# Altium project TEBF0808.PrjPCB (part 3 of 6)

## Sheet SC.schdoc: TEBF0808 - CPLD
size A4; DocumentNumber: TEBF0808; Revision: 04; SheetNumber: 26; SheetTotal: 36; Date: 2016-09-29; CompanyName: Trenz Electronic GmbH; Organization: Trenz Electronic GmbH
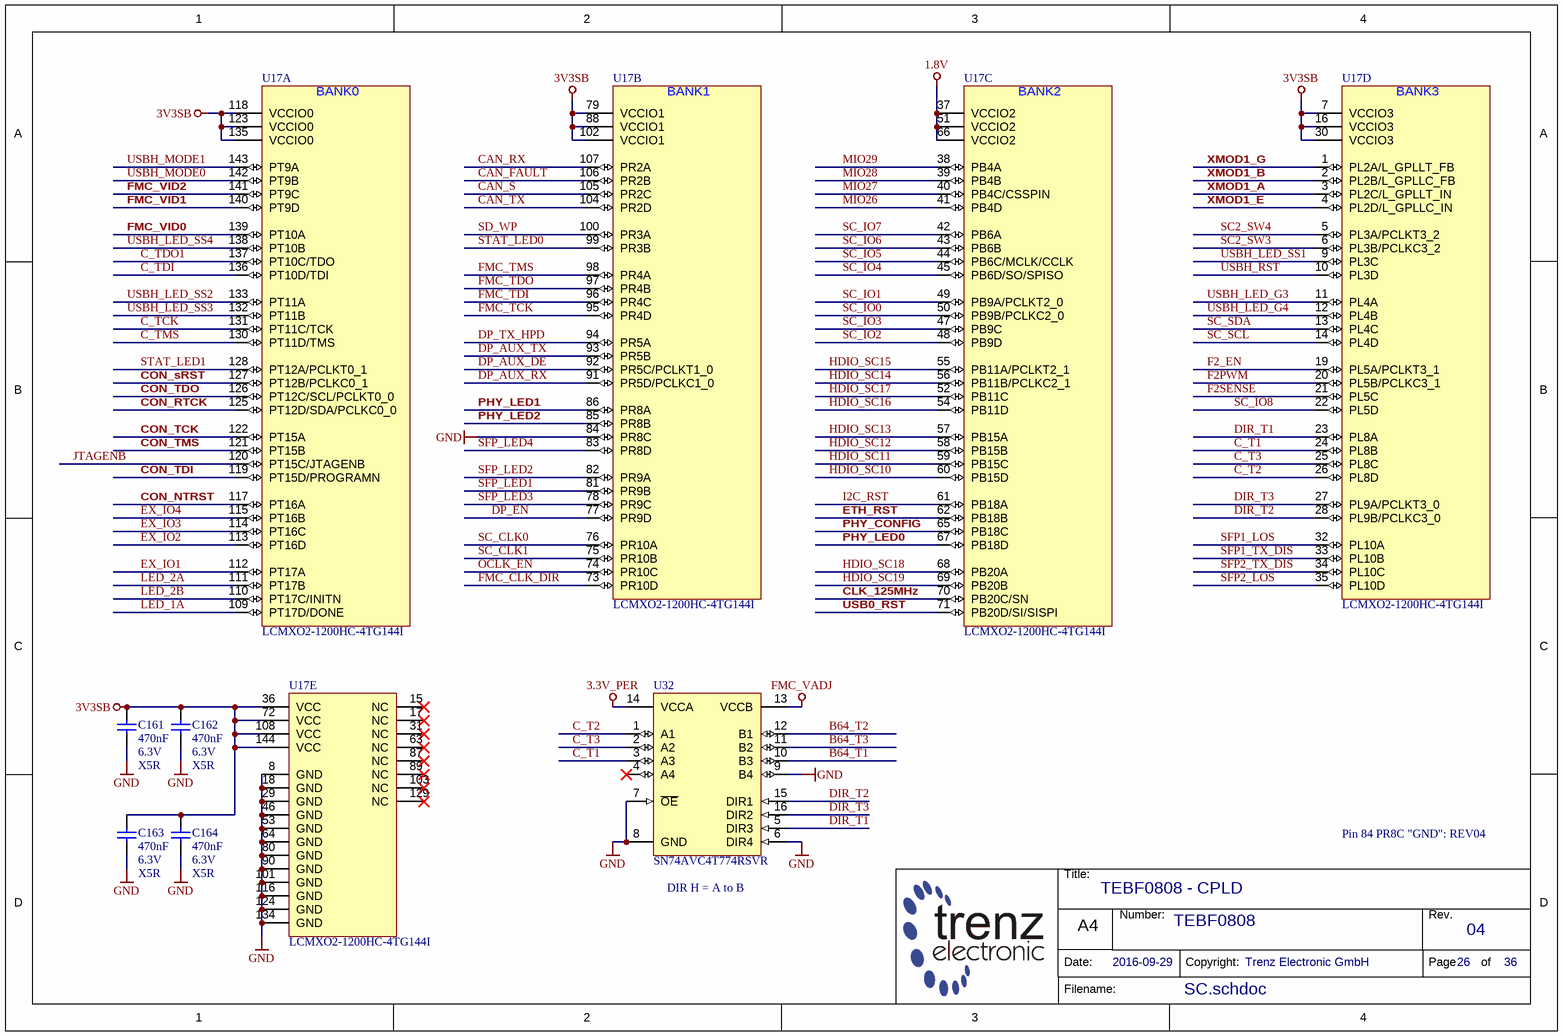
[diagram p11: SC.schdoc]

### Parts
C161  470nF  Voltage: 6.3V  Technology: X5R  [CAPC1005X55N]
C162  470nF  Voltage: 6.3V  Technology: X5R  [CAPC1005X55N]
C163  470nF  Voltage: 6.3V  Technology: X5R  [CAPC1005X55N]
C164  470nF  Voltage: 6.3V  Technology: X5R  [CAPC1005X55N]
U17  LCMXO2-1200HC-4TG144I  [QFP50P2200X2200X160-144N]  (parts A,B,C,D,E of 5)
U32  SN74AVC4T774RSVR  [QFN40P260X180X55-16N]

### Nets
1.8V: U17.37(VCCIO2) U17.51(VCCIO2) U17.66(VCCIO2)
3.3V_PER: U32.14(VCCA)
3V3SB: C161.1 C162.1 C163.1 C164.1 U17.7(VCCIO3) U17.16(VCCIO3) U17.30(VCCIO3) U17.36(VCC) U17.72(VCC) U17.79(VCCIO1) U17.88(VCCIO1) U17.102(VCCIO1) U17.108(VCC) U17.118(VCCIO0) U17.123(VCCIO0) U17.135(VCCIO0) U17.144(VCC)
FMC_VADJ: U32.13(VCCB)
GND: C161.2 C162.2 C163.2 C164.2 U17.8(GND) U17.18(GND) U17.29(GND) U17.46(GND) U17.53(GND) U17.64(GND) U17.80(GND) U17.84(PR8C) U17.90(GND) U17.101(GND) U17.116(GND) U17.124(GND) U17.134(GND) U32.6(DIR4) U32.7(~{OE}) U32.8(GND) U32.9(B4)
B64_T1: U32.10(B3)
B64_T2: U32.12(B1)
B64_T3: U32.11(B2)
C_T1: U17.24(PL8B) U32.3(A3)
C_T2: U17.26(PL8D) U32.1(A1)
C_T3: U17.25(PL8C) U32.2(A2)
C_TCK: U17.131(PT11C/TCK)
C_TDI: U17.136(PT10D/TDI)
C_TDO1: U17.137(PT10C/TDO)
C_TMS: U17.130(PT11D/TMS)
CAN_FAULT: U17.106(PR2B)
CAN_RX: U17.107(PR2A)
CAN_S: U17.105(PR2C)
CAN_TX: U17.104(PR2D)
CLK_125MHz: U17.70(PB20C/SN)
CON_NTRST: U17.117(PT16A)
CON_RTCK: U17.125(PT12D/SDA/PCLKC0_0)
CON_sRST: U17.127(PT12B/PCLKC0_1)
CON_TCK: U17.122(PT15A)
CON_TDI: U17.119(PT15D/PROGRAMN)
CON_TDO: U17.126(PT12C/SCL/PCLKT0_0)
CON_TMS: U17.121(PT15B)
DIR_T1: U17.23(PL8A) U32.5(DIR3)
DIR_T2: U17.28(PL9B/PCLKC3_0) U32.15(DIR1)
DIR_T3: U17.27(PL9A/PCLKT3_0) U32.16(DIR2)
DP_AUX_DE: U17.92(PR5C/PCLKT1_0)
DP_AUX_RX: U17.91(PR5D/PCLKC1_0)
DP_AUX_TX: U17.93(PR5B)
DP_EN: U17.77(PR9D)
DP_TX_HPD: U17.94(PR5A)
ETH_RST: U17.62(PB18B)
EX_IO1: U17.112(PT17A)
EX_IO2: U17.113(PT16D)
EX_IO3: U17.114(PT16C)
EX_IO4: U17.115(PT16B)
F2_EN: U17.19(PL5A/PCLKT3_1)
F2PWM: U17.20(PL5B/PCLKC3_1)
F2SENSE: U17.21(PL5C)
FMC_CLK_DIR: U17.73(PR10D)
FMC_TCK: U17.95(PR4D)
FMC_TDI: U17.96(PR4C)
FMC_TDO: U17.97(PR4B)
FMC_TMS: U17.98(PR4A)
FMC_VID0: U17.139(PT10A)
FMC_VID1: U17.140(PT9D)
FMC_VID2: U17.141(PT9C)
HDIO_SC10: U17.60(PB15D)
HDIO_SC11: U17.59(PB15C)
HDIO_SC12: U17.58(PB15B)
HDIO_SC13: U17.57(PB15A)
HDIO_SC14: U17.56(PB11B/PCLKC2_1)
HDIO_SC15: U17.55(PB11A/PCLKT2_1)
HDIO_SC16: U17.54(PB11D)
HDIO_SC17: U17.52(PB11C)
HDIO_SC18: U17.68(PB20A)
HDIO_SC19: U17.69(PB20B)
I2C_RST: U17.61(PB18A)
JTAGENB: U17.120(PT15C/JTAGENB)
LED_1A: U17.109(PT17D/DONE)
LED_2A: U17.111(PT17B)
LED_2B: U17.110(PT17C/INITN)
MIO26: U17.41(PB4D)
MIO27: U17.40(PB4C/CSSPIN)
MIO28: U17.39(PB4B)
MIO29: U17.38(PB4A)
OCLK_EN: U17.74(PR10C)
PHY_CONFIG: U17.65(PB18C)
PHY_LED0: U17.67(PB18D)
PHY_LED1: U17.86(PR8A)
PHY_LED2: U17.85(PR8B)
SC2_SW3: U17.6(PL3B/PCLKC3_2)
SC2_SW4: U17.5(PL3A/PCLKT3_2)
SC_CLK0: U17.76(PR10A)
SC_CLK1: U17.75(PR10B)
SC_IO0: U17.50(PB9B/PCLKC2_0)
SC_IO1: U17.49(PB9A/PCLKT2_0)
SC_IO2: U17.48(PB9D)
SC_IO3: U17.47(PB9C)
SC_IO4: U17.45(PB6D/SO/SPISO)
SC_IO5: U17.44(PB6C/MCLK/CCLK)
SC_IO6: U17.43(PB6B)
SC_IO7: U17.42(PB6A)
SC_IO8: U17.22(PL5D)
SC_SCL: U17.14(PL4D)
SC_SDA: U17.13(PL4C)
SD_WP: U17.100(PR3A)
SFP1_LOS: U17.32(PL10A)
SFP1_TX_DIS: U17.33(PL10B)
SFP2_LOS: U17.35(PL10D)
SFP2_TX_DIS: U17.34(PL10C)
SFP_LED1: U17.81(PR9B)
SFP_LED2: U17.82(PR9A)
SFP_LED3: U17.78(PR9C)
SFP_LED4: U17.83(PR8D)
STAT_LED0: U17.99(PR3B)
STAT_LED1: U17.128(PT12A/PCLKT0_1)
USB0_RST: U17.71(PB20D/SI/SISPI)
USBH_LED_G3: U17.11(PL4A)
USBH_LED_G4: U17.12(PL4B)
USBH_LED_SS1: U17.9(PL3C)
USBH_LED_SS2: U17.133(PT11A)
USBH_LED_SS3: U17.132(PT11B)
USBH_LED_SS4: U17.138(PT10B)
USBH_MODE0: U17.142(PT9B)
USBH_MODE1: U17.143(PT9A)
USBH_RST: U17.10(PL3D)
XMOD1_A: U17.3(PL2C/L_GPLLT_IN)
XMOD1_B: U17.2(PL2B/L_GPLLC_FB)
XMOD1_E: U17.4(PL2D/L_GPLLC_IN)
XMOD1_G: U17.1(PL2A/L_GPLLT_FB)

Not connected (* = marked no-connect by the designer): U17 15(NC)* 17(NC)* 31(NC)* 63(NC)* 87(NC)* 89(NC)* 103(NC)* 129(NC)*; U32 4(A4)*

### Notes on the sheet
- Pin 84 PR8C "GND": REV04
- (near U32) DIR H = A to B
- Title:
- Number:
- Rev.
- Date:
- A4
- Copyright:
- Page
- of
- Filename:
- (in symbol 25915, part A) BANK0
- (in symbol 25915, part B) BANK1
- (in symbol 25915, part C) BANK2
- (in symbol 25915, part D) BANK3

### Library data of the parts
C161-C164 = 23659: KON 470nF 6,3V X5R SMD; AN: 23659; Mixed: SMT; Value: 470n; Preferred: Yes; Case: 1005 (0402)
U17 = 25915: AN: 25915; Mixed: SMT; Trenz-Stock: Yes; Case: TQFP144; HelpURL: B:\AD\adlib\datasheet\MachXO2; H-ART: LCMXO2-1200HC-4TG144I
U32 = 27170: AN: 27170; Mixed: SMT; Trenz-Stock: Yes; Case: UQFN-16; HelpURL: B:\ad\adlib\datasheet\sn74avc4t774; H-ART: SN74AVC4T774RSVR

## Sheet SC2.schdoc: TEBF0808 - CPLD_2
size A4; DocumentNumber: TEBF0808; Revision: 04; SheetNumber: 27; SheetTotal: 36; Date: 2016-09-29; CompanyName: Trenz Electronic GmbH; Organization: Trenz Electronic GmbH
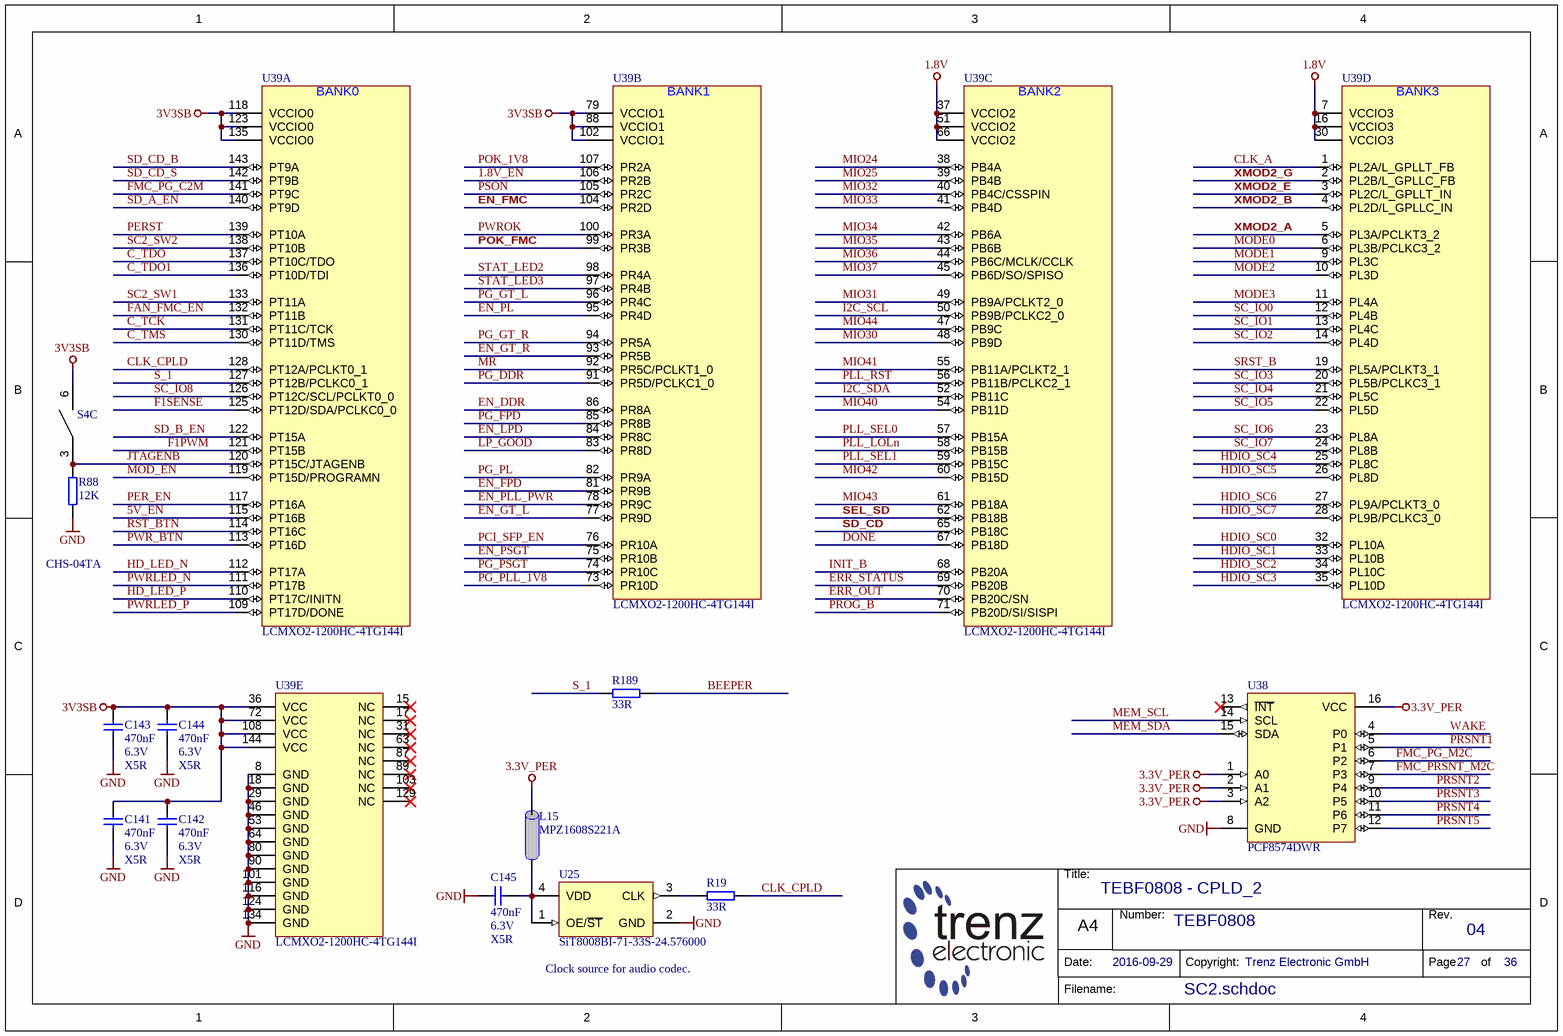
[diagram p12: SC2.schdoc]

### Parts
C141  470nF  Voltage: 6.3V  Technology: X5R  [CAPC1005X55N]
C142  470nF  Voltage: 6.3V  Technology: X5R  [CAPC1005X55N]
C143  470nF  Voltage: 6.3V  Technology: X5R  [CAPC1005X55N]
C144  470nF  Voltage: 6.3V  Technology: X5R  [CAPC1005X55N]
C145  470nF  Voltage: 6.3V  Technology: X5R  [CAPC1005X55N]
L15  MPZ1608S221A  [INDC1608X95N]
R19  33R  [RESC1005X40N]
R88  12K  [RESC1005X40N]
R189  33R  [RESC1005X40N]
S4  CHS-04TA  [CHS-04TA]  (part C of 4)
U25  SiT8008BI-71-33S-24.576000  [2016]
U38  PCF8574DWR  [SOIC127P1030X265-16N]
U39  LCMXO2-1200HC-4TG144I  [QFP50P2200X2200X160-144N]  (parts A,B,C,D,E of 5)

### Nets
1.8V: U39.7(VCCIO3) U39.16(VCCIO3) U39.30(VCCIO3) U39.37(VCCIO2) U39.51(VCCIO2) U39.66(VCCIO2)
3.3V_PER: L15.2 U38.1(A0) U38.2(A1) U38.3(A2) U38.16(VCC)
3V3SB: C141.1 C142.1 C143.1 C144.1 S4.6 U39.36(VCC) U39.72(VCC) U39.79(VCCIO1) U39.88(VCCIO1) U39.102(VCCIO1) U39.108(VCC) U39.118(VCCIO0) U39.123(VCCIO0) U39.135(VCCIO0) U39.144(VCC)
GND: C141.2 C142.2 C143.2 C144.2 C145.2 R88.1 U25.2(GND) U38.8(GND) U39.8(GND) U39.18(GND) U39.29(GND) U39.46(GND) U39.53(GND) U39.64(GND) U39.80(GND) U39.90(GND) U39.101(GND) U39.116(GND) U39.124(GND) U39.134(GND)
1.8V_EN: U39.106(PR2B)
5V_EN: U39.115(PT16B)
BEEPER: R189.2
C_TCK: U39.131(PT11C/TCK)
C_TDO: U39.137(PT10C/TDO)
C_TDO1: U39.136(PT10D/TDI)
C_TMS: U39.130(PT11D/TMS)
CLK_A: U39.1(PL2A/L_GPLLT_FB)
CLK_CPLD: R19.2 U39.128(PT12A/PCLKT0_1)
DONE: U39.67(PB18D)
EN_DDR: U39.86(PR8A)
EN_FMC: U39.104(PR2D)
EN_FPD: U39.81(PR9B)
EN_GT_L: U39.77(PR9D)
EN_GT_R: U39.93(PR5B)
EN_LPD: U39.84(PR8C)
EN_PL: U39.95(PR4D)
EN_PLL_PWR: U39.78(PR9C)
EN_PSGT: U39.75(PR10B)
ERR_OUT: U39.70(PB20C/SN)
ERR_STATUS: U39.69(PB20B)
F1PWM: U39.121(PT15B)
F1SENSE: U39.125(PT12D/SDA/PCLKC0_0)
FAN_FMC_EN: U39.132(PT11B)
FMC_PG_C2M: U39.141(PT9C)
FMC_PG_M2C: U38.6(P2)
FMC_PRSNT_M2C: U38.7(P3)
HD_LED_N: U39.112(PT17A)
HD_LED_P: U39.110(PT17C/INITN)
HDIO_SC0: U39.32(PL10A)
HDIO_SC1: U39.33(PL10B)
HDIO_SC2: U39.34(PL10C)
HDIO_SC3: U39.35(PL10D)
HDIO_SC4: U39.25(PL8C)
HDIO_SC5: U39.26(PL8D)
HDIO_SC6: U39.27(PL9A/PCLKT3_0)
HDIO_SC7: U39.28(PL9B/PCLKC3_0)
I2C_SCL: U39.50(PB9B/PCLKC2_0)
I2C_SDA: U39.52(PB11C)
INIT_B: U39.68(PB20A)
JTAGENB: R88.2 S4.3 U39.120(PT15C/JTAGENB)
LP_GOOD: U39.83(PR8D)
MEM_SCL: U38.14(SCL)
MEM_SDA: U38.15(SDA)
MIO24: U39.38(PB4A)
MIO25: U39.39(PB4B)
MIO30: U39.48(PB9D)
MIO31: U39.49(PB9A/PCLKT2_0)
MIO32: U39.40(PB4C/CSSPIN)
MIO33: U39.41(PB4D)
MIO34: U39.42(PB6A)
MIO35: U39.43(PB6B)
MIO36: U39.44(PB6C/MCLK/CCLK)
MIO37: U39.45(PB6D/SO/SPISO)
MIO40: U39.54(PB11D)
MIO41: U39.55(PB11A/PCLKT2_1)
MIO42: U39.60(PB15D)
MIO43: U39.61(PB18A)
MIO44: U39.47(PB9C)
MOD_EN: U39.119(PT15D/PROGRAMN)
MODE0: U39.6(PL3B/PCLKC3_2)
MODE1: U39.9(PL3C)
MODE2: U39.10(PL3D)
MODE3: U39.11(PL4A)
MR: U39.92(PR5C/PCLKT1_0)
PCI_SFP_EN: U39.76(PR10A)
PER_EN: U39.117(PT16A)
PERST: U39.139(PT10A)
PG_DDR: U39.91(PR5D/PCLKC1_0)
PG_FPD: U39.85(PR8B)
PG_GT_L: U39.96(PR4C)
PG_GT_R: U39.94(PR5A)
PG_PL: U39.82(PR9A)
PG_PLL_1V8: U39.73(PR10D)
PG_PSGT: U39.74(PR10C)
PLL_LOLn: U39.58(PB15B)
PLL_RST: U39.56(PB11B/PCLKC2_1)
PLL_SEL0: U39.57(PB15A)
PLL_SEL1: U39.59(PB15C)
POK_1V8: U39.107(PR2A)
POK_FMC: U39.99(PR3B)
PROG_B: U39.71(PB20D/SI/SISPI)
PRSNT1: U38.5(P1)
PRSNT2: U38.9(P4)
PRSNT3: U38.10(P5)
PRSNT4: U38.11(P6)
PRSNT5: U38.12(P7)
PSON: U39.105(PR2C)
PWR_BTN: U39.113(PT16D)
PWRLED_N: U39.111(PT17B)
PWRLED_P: U39.109(PT17D/DONE)
PWROK: U39.100(PR3A)
RST_BTN: U39.114(PT16C)
S_1: R189.1 U39.127(PT12B/PCLKC0_1)
SC2_SW1: U39.133(PT11A)
SC2_SW2: U39.138(PT10B)
SC_IO0: U39.12(PL4B)
SC_IO1: U39.13(PL4C)
SC_IO2: U39.14(PL4D)
SC_IO3: U39.20(PL5B/PCLKC3_1)
SC_IO4: U39.21(PL5C)
SC_IO5: U39.22(PL5D)
SC_IO6: U39.23(PL8A)
SC_IO7: U39.24(PL8B)
SC_IO8: U39.126(PT12C/SCL/PCLKT0_0)
SD_A_EN: U39.140(PT9D)
SD_B_EN: U39.122(PT15A)
SD_CD: U39.65(PB18C)
SD_CD_B: U39.143(PT9A)
SD_CD_S: U39.142(PT9B)
SEL_SD: U39.62(PB18B)
SRST_B: U39.19(PL5A/PCLKT3_1)
STAT_LED2: U39.98(PR4A)
STAT_LED3: U39.97(PR4B)
WAKE: U38.4(P0)
XMOD2_A: U39.5(PL3A/PCLKT3_2)
XMOD2_B: U39.4(PL2D/L_GPLLC_IN)
XMOD2_E: U39.3(PL2C/L_GPLLT_IN)
XMOD2_G: U39.2(PL2B/L_GPLLC_FB)
NetC145_1: C145.1 L15.1 U25.1(OE/~{ST}) U25.4(VDD)
NetR19_1: R19.1 U25.3(CLK)

Not connected (* = marked no-connect by the designer): U38 13(~{INT})*; U39 15(NC)* 17(NC)* 31(NC)* 63(NC)* 87(NC)* 89(NC)* 103(NC)* 129(NC)*

### Notes on the sheet
- (near U25) Clock source for audio codec.
- Title:
- Number:
- Rev.
- Date:
- A4
- Copyright:
- Page
- of
- Filename:
- (in symbol 25915, part A) BANK0
- (in symbol 25915, part B) BANK1
- (in symbol 25915, part C) BANK2
- (in symbol 25915, part D) BANK3

### Library data of the parts
C141-C144 = 23659: as C161-C164 on sheet SC; Case: 1005 (0402)
C145 = 23659: KON 470nF 6,3V X5R SMD; AN: 23659; Value: 470n; Mixed: SMT; Preferred: Yes; Case: 1005 (0402)
L15 = 22718: Ferritdurchführung MPZ1608S221A; AN: 22718; Mixed: SMT; Trenz-Stock: Yes; Value: 220 OHm @ 100MHz; Case: 1608 (0603); HelpURL: B:\AD\adlib\datasheet\MPZ1608; Preferred: Yes; H-ART: MPZ1608S221A
R19 R189 = 22770: WID SMD 33R 1% 0,063W; AN: 22770; Mixed: SMT; Value: 33; Preferred: Yes; Tolerance: 1%; Case: 1005 (0402); Technology: TK100
R88 = 22598: WID SMD 12K 1% 0,063W; AN: 22598; Mixed: SMT; Preferred: Yes; Tolerance: 1%; Case: 1005 (0402); Technology: TK100; Value: 12K
S4 = 23417: DIP Schalter 4 fach 1,27mm SMD; AN: 23417; Mixed: SMT; Trenz-Stock: Yes; HelpURL: B:\AD\adlib\datasheet\CHS; Preferred: Yes; H-ART: CHS-04TA
U25 = 27547: SiT8008BI-71-33S-24.576000 MEMS Oszillator 24.576000MHz; AN: 27547; Mixed: SMT; Trenz-Stock: Yes; Value: 24.576M; Case: 2.0  x 1.6mm; HelpURL: B:\AD\adlib\datasheet\SiT8008; Preferred: Yes; H-ART: SiT8008BI-71-33S-24.576000
U38 = 26502: AN: 26502; Mixed: SMT; Case: SO16W DW; HelpURL: B:\AD\adlib\datasheet\PCF8574; H-ART: PCF8574DWR
U39 = 25915: AN: 25915; Mixed: SMT; Trenz-Stock: Yes; Case: TQFP144; HelpURL: B:\AD\adlib\datasheet\MachXO2; H-ART: LCMXO2-1200HC-4TG144I

## Sheet XMOD.schdoc: TEBF0808 - XMOD JTAG
size A4; DocumentNumber: TEBF0808; Revision: 04; SheetNumber: 29; SheetTotal: 36; Date: 2016-09-29; CompanyName: Trenz Electronic GmbH; Organization: Trenz Electronic GmbH
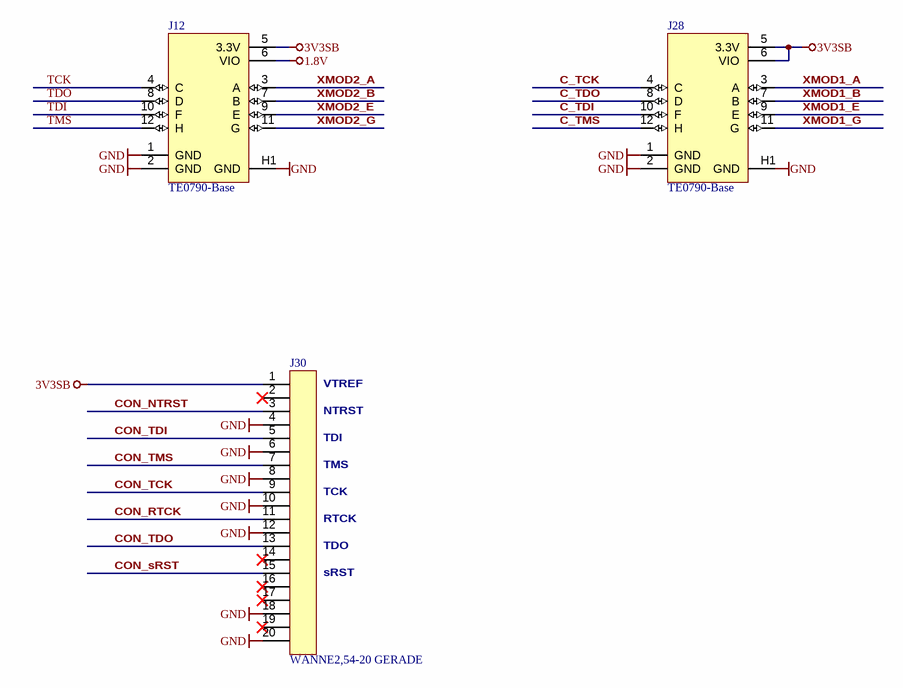
[diagram p13: XMOD.schdoc]

### Parts
J12  TE0790-Base  [TE0790-Base]
J28  TE0790-Base  [TE0790-Base]
J30  WANNE2,54-20 GERADE  [WANNE2,54-20 GERADE]

### Nets
1.8V: J12.6(VIO)
3V3SB: J12.5(3.3V) J28.5(3.3V) J28.6(VIO) J30.1
GND: J12.1(GND) J12.2(GND) J12.H1(GND) J28.1(GND) J28.2(GND) J28.H1(GND) J30.4 J30.6 J30.8 J30.10 J30.12 J30.18 J30.20
C_TCK: J28.4(C)
C_TDI: J28.10(F)
C_TDO: J28.8(D)
C_TMS: J28.12(H)
CON_NTRST: J30.3
CON_RTCK: J30.11
CON_sRST: J30.15
CON_TCK: J30.9
CON_TDI: J30.5
CON_TDO: J30.13
CON_TMS: J30.7
TCK: J12.4(C)
TDI: J12.10(F)
TDO: J12.8(D)
TMS: J12.12(H)
XMOD1_A: J28.3(A)
XMOD1_B: J28.7(B)
XMOD1_E: J28.9(E)
XMOD1_G: J28.11(G)
XMOD2_A: J12.3(A)
XMOD2_B: J12.7(B)
XMOD2_E: J12.9(E)
XMOD2_G: J12.11(G)

Not connected (* = marked no-connect by the designer): J30 2* 14* 16* 17* 19*

### Notes on the sheet
- (near J30) VTREF
- (near J30) TDI
- (near J30) NTRST
- (near J30) TMS
- (near J30) TCK
- (near J30) RTCK
- (near J30) TDO
- (near J30) sRST
- Title:
- Number:
- Rev.
- Date:
- A4
- Copyright:
- Page
- of
- Filename:

### Library data of the parts
J12 J28 = 26694: AN: 26694; Mixed: THT; Trenz-Article-Number: 22495
J30 = 20127: Stiftleiste Wanne 20polig; AN: 20127; Trenz-Stock: Yes; Mixed: THT; HelpURL: B:\AD\adlib\datasheet\137

## Sheet Power_1.schdoc: TEBF0808 - Power
size A4; DocumentNumber: TEBF0808; Revision: 04; SheetNumber: 31; SheetTotal: 36; Date: 2016-09-29; CompanyName: Trenz Electronic GmbH; Organization: Trenz Electronic GmbH
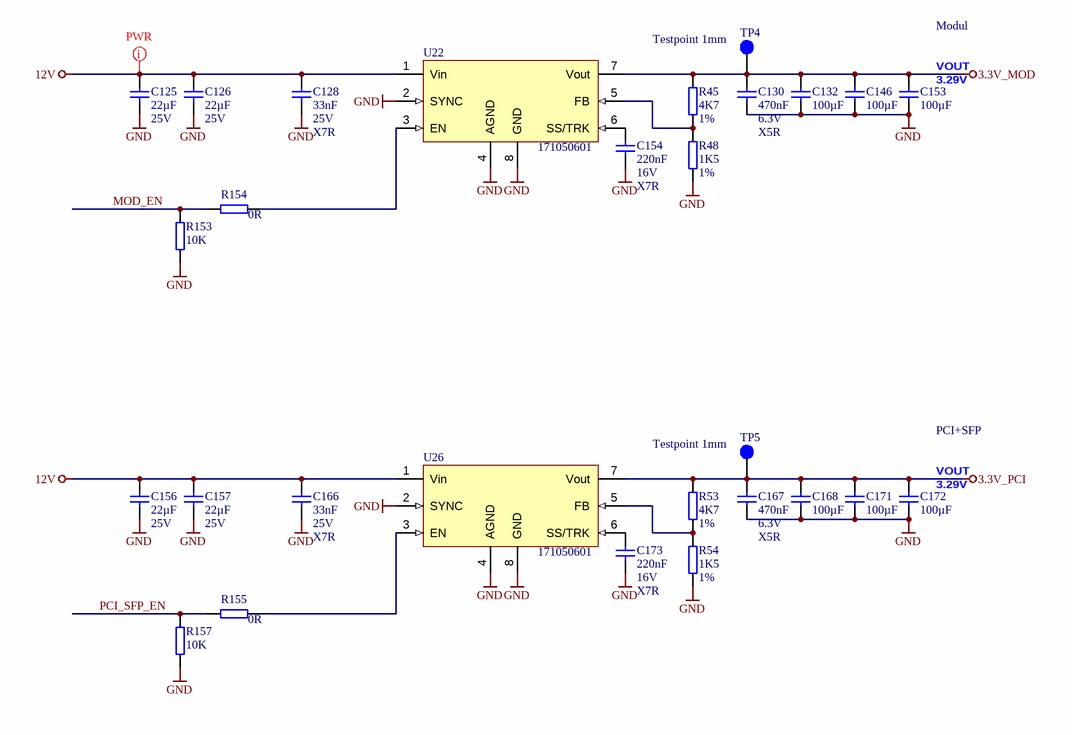
[diagram p14: Power_1.schdoc]

### Parts
C125  22µF  Voltage: 25V  [CAPC3216X180N]
C126  22µF  Voltage: 25V  [CAPC3216X180N]
C128  33nF  Voltage: 25V  Technology: X7R  [CAPC1005X55N]
C130  470nF  Voltage: 6.3V  Technology: X5R  [CAPC1005X55N]
C132  100µF  [CAPC3216X180N]
C146  100µF  [CAPC3216X180N]
C153  100µF  [CAPC3216X180N]
C154  220nF  Voltage: 16V  Technology: X7R  [CAPC1005X55N]
C156  22µF  Voltage: 25V  [CAPC3216X180N]
C157  22µF  Voltage: 25V  [CAPC3216X180N]
C166  33nF  Voltage: 25V  Technology: X7R  [CAPC1005X55N]
C167  470nF  Voltage: 6.3V  Technology: X5R  [CAPC1005X55N]
C168  100µF  [CAPC3216X180N]
C171  100µF  [CAPC3216X180N]
C172  100µF  [CAPC3216X180N]
C173  220nF  Voltage: 16V  Technology: X7R  [CAPC1005X55N]
R45  4K7  Tolerance: 1%  [RESC1005X40N]
R48  1K5  Tolerance: 1%  [RESC1005X40N]
R53  4K7  Tolerance: 1%  [RESC1005X40N]
R54  1K5  Tolerance: 1%  [RESC1005X40N]
R153  10K  [RESC1005X40N]
R154  0R  [RESC1005X40N]
R155  0R  [RESC1005X40N]
R157  10K  [RESC1005X40N]
TP4  Testpoint 1mm  [TP_1mm]
TP5  Testpoint 1mm  [TP_1mm]
U22  171050601  [7TO-PMOD]
U26  171050601  [7TO-PMOD]

### Nets
3.3V_MOD: C130.1 C132.1 C146.1 C153.1 R45.1 TP4.1 U22.7(Vout)
3.3V_PCI: C167.1 C168.1 C171.1 C172.1 R53.1 TP5.1 U26.7(Vout)
12V: C125.2 C126.2 C128.1 C156.2 C157.2 C166.1 U22.1(Vin) U26.1(Vin)
GND: C125.1 C126.1 C128.2 C130.2 C132.2 C146.2 C153.2 C154.2 C156.1 C157.1 C166.2 C167.2 C168.2 C171.2 C172.2 C173.2 R48.2 R54.2 R153.1 R157.1 U22.2(SYNC) U22.4(AGND) U22.8(GND) U26.2(SYNC) U26.4(AGND) U26.8(GND)
MOD_EN: R153.2 R154.2
PCI_SFP_EN: R155.2 R157.2
NetC154_1: C154.1 U22.6(SS/TRK)
NetC173_1: C173.1 U26.6(SS/TRK)
NetR45_2: R45.2 R48.1 U22.5(FB)
NetR53_2: R53.2 R54.1 U26.5(FB)
NetR154_1: R154.1 U22.3(EN)
NetR155_1: R155.1 U26.3(EN)

### Layout directives
net class PWR: 12V

### Notes on the sheet
- Modul
- (near C153) VOUT
- (near C153) 3.29V
- PCI+SFP
- (near C172) 3.29V
- (near C172) VOUT
- Title:
- Number:
- Rev.
- Date:
- A4
- Copyright:
- Page
- of
- Filename:

### Library data of the parts
C125 C126 C156 C157 = 24886: KON 22µF X5R 25V SMD 10%; AN: 24886; Value: 22u; Mixed: SMT; Preferred: Yes; Case: 3216 (1206); Tolerance: 10%
C128 C166 = 23916: KON 33nF 25V X7R SMD; AN: 23916; Value: 33n; Mixed: SMT; Preferred: Yes; Case: 1005 (0402)
C130 C167 = 23659: as C161-C164 on sheet SC; Case: 1005 (0402)
C132 C146 C153 C168 C171 C172 = 23116: KON 100µF 6,3V X5R SMD 20%; AN: 23116; Mixed: SMT; Value: 100u; Preferred: Yes; Voltage: 6.3V; Case: 3216 (1206); Tolerance: 20%; Technology: X5R
C154 C173 = 22768: KON 220nF 16V X7R SMD; AN: 22768; Mixed: SMT; Value: 220n; Case: 1005 (0402)
R45 R53 = 22585: WID SMD 4K7 1% 0,063W; AN: 22585; Mixed: SMT; Value: 4.7K; Preferred: Yes; Case: 1005 (0402); Technology: TK100
R48 R54 = 22602: WID SMD 1K5 1% 0,063W; AN: 22602; Mixed: SMT; Value: 1.5K; Preferred: Yes; Case: 1005 (0402); Technology: TK100
R153 R157 = 22750: WID SMD 10K 1% 0,063W; AN: 22750; Mixed: SMT; Preferred: Yes; Case: 1005 (0402); Value: 10K; Tolerance: 1%; Technology: TK100
R154 R155 = 22738: WID SMD 0R; AN: 22738; Tolerance: 1%; Mixed: SMT; Value: 0; Preferred: Yes; Case: 1005 (0402); Technology: TK100
TP4 TP5 = 25063: AN: 25063; Mixed: SMT
U22 U26 = 26051: AN: 26051; Mixed: SMT; Case: TO263-7EP; HelpURL: B:\AD\adlib\datasheet\171050601; H-ART: 171050601

## Sheet B2B.schdoc: TEBF0808 - B2B-connectors
size A4; DocumentNumber: TEBF0808; Revision: 04; SheetNumber: 2; SheetTotal: 36; Date: 2016-09-29; CompanyName: Trenz Electronic GmbH; Organization: Trenz Electronic GmbH
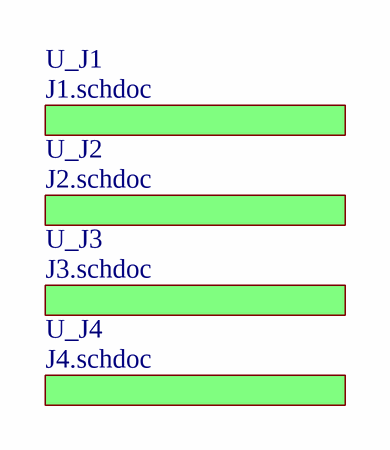
[diagram p15: B2B.schdoc]

### Sub-sheets
U_J1 = J1.schdoc: no entries
U_J2 = J2.schdoc: no entries
U_J3 = J3.schdoc: no entries
U_J4 = J4.schdoc: no entries

### Notes on the sheet
- Title:
- Number:
- Rev.
- Date:
- A4
- Copyright:
- Page
- of
- Filename:

## Sheet J1.schdoc: TEBF0808 - B2B-connector J1
size A4; DocumentNumber: TEBF0808; Revision: 04; SheetNumber: 3; SheetTotal: 36; Date: 2016-09-29; CompanyName: Trenz Electronic GmbH; Organization: Trenz Electronic GmbH
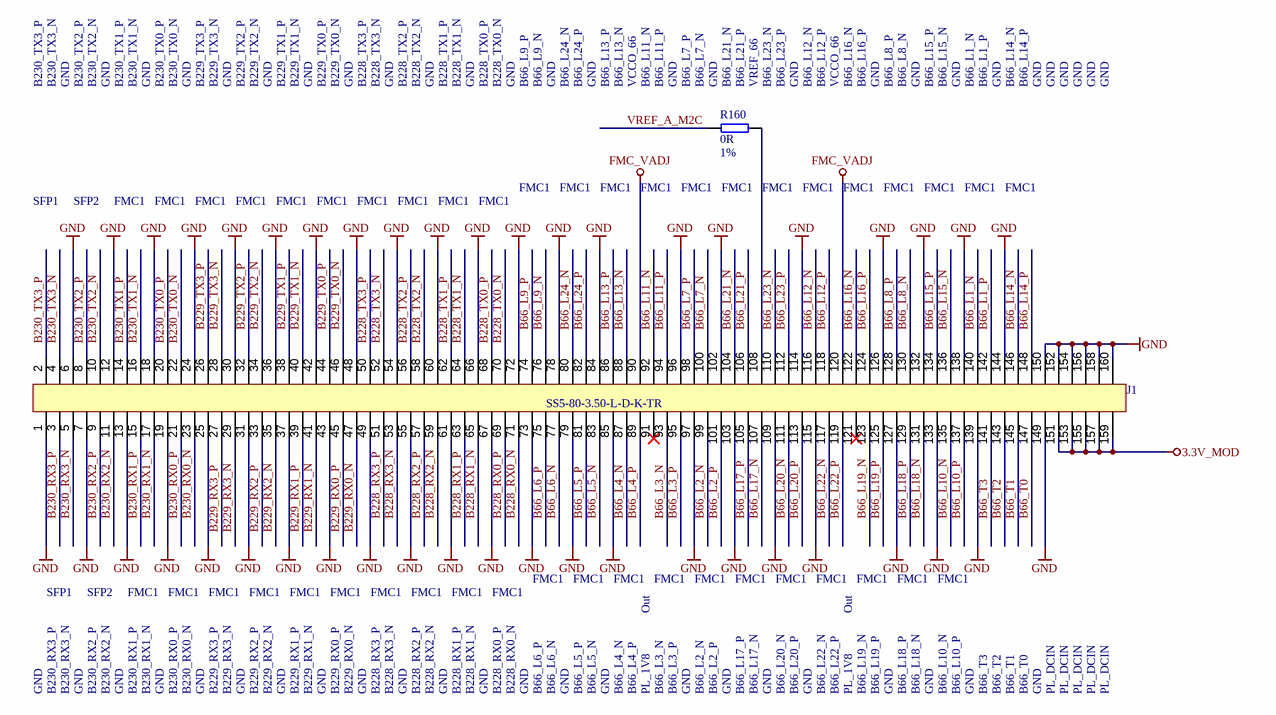
[diagram p16: J1.schdoc]

### Parts
J1  SS5-80-3.50-L-D-K-TR  [SS5-80-3.50-L-D-K-TR]
R160  0R  Tolerance: 1%  [RESC1005X40N]

### Nets
3.3V_MOD: J1.151 J1.153 J1.155 J1.157 J1.159
FMC_VADJ: J1.90 J1.120
GND: J1.1 J1.6 J1.7 J1.12 J1.13 J1.18 J1.19 J1.24 J1.25 J1.30 J1.31 J1.36 J1.37 J1.42 J1.43 J1.48 J1.49 J1.54 J1.55 J1.60 J1.61 J1.66 J1.67 J1.72 J1.73 J1.78 J1.79 J1.84 J1.85 J1.96 J1.97 J1.102 J1.103 J1.109 J1.114 J1.115 J1.126 J1.127 J1.132 J1.133 J1.138 J1.139 J1.144 J1.149 J1.150 J1.152 J1.154 J1.156 J1.158 J1.160
B66_L1_N: J1.140
B66_L1_P: J1.142
B66_L2_N: J1.99
B66_L2_P: J1.101
B66_L3_N: J1.93
B66_L3_P: J1.95
B66_L4_N: J1.87
B66_L4_P: J1.89
B66_L5_N: J1.83
B66_L5_P: J1.81
B66_L6_N: J1.77
B66_L6_P: J1.75
B66_L7_N: J1.100
B66_L7_P: J1.98
B66_L8_N: J1.130
B66_L8_P: J1.128
B66_L9_N: J1.76
B66_L9_P: J1.74
B66_L10_N: J1.135
B66_L10_P: J1.137
B66_L11_N: J1.92
B66_L11_P: J1.94
B66_L12_N: J1.116
B66_L12_P: J1.118
B66_L13_N: J1.88
B66_L13_P: J1.86
B66_L14_N: J1.146
B66_L14_P: J1.148
B66_L15_N: J1.136
B66_L15_P: J1.134
B66_L16_N: J1.122
B66_L16_P: J1.124
B66_L17_N: J1.107
B66_L17_P: J1.105
B66_L18_N: J1.131
B66_L18_P: J1.129
B66_L19_N: J1.123
B66_L19_P: J1.125
B66_L20_N: J1.111
B66_L20_P: J1.113
B66_L21_N: J1.104
B66_L21_P: J1.106
B66_L22_N: J1.117
B66_L22_P: J1.119
B66_L23_N: J1.110
B66_L23_P: J1.112
B66_L24_N: J1.80
B66_L24_P: J1.82
B66_T0: J1.147
B66_T1: J1.145
B66_T2: J1.143
B66_T3: J1.141
B228_RX0_N: J1.71
B228_RX0_P: J1.69
B228_RX1_N: J1.65
B228_RX1_P: J1.63
B228_RX2_N: J1.59
B228_RX2_P: J1.57
B228_RX3_N: J1.53
B228_RX3_P: J1.51
B228_TX0_N: J1.70
B228_TX0_P: J1.68
B228_TX1_N: J1.64
B228_TX1_P: J1.62
B228_TX2_N: J1.58
B228_TX2_P: J1.56
B228_TX3_N: J1.52
B228_TX3_P: J1.50
B229_RX0_N: J1.47
B229_RX0_P: J1.45
B229_RX1_N: J1.41
B229_RX1_P: J1.39
B229_RX2_N: J1.35
B229_RX2_P: J1.33
B229_RX3_N: J1.29
B229_RX3_P: J1.27
B229_TX0_N: J1.46
B229_TX0_P: J1.44
B229_TX1_N: J1.40
B229_TX1_P: J1.38
B229_TX2_N: J1.34
B229_TX2_P: J1.32
B229_TX3_N: J1.28
B229_TX3_P: J1.26
B230_RX0_N: J1.23
B230_RX0_P: J1.21
B230_RX1_N: J1.17
B230_RX1_P: J1.15
B230_RX2_N: J1.11
B230_RX2_P: J1.9
B230_RX3_N: J1.5
B230_RX3_P: J1.3
B230_TX0_N: J1.22
B230_TX0_P: J1.20
B230_TX1_N: J1.16
B230_TX1_P: J1.14
B230_TX2_N: J1.10
B230_TX2_P: J1.8
B230_TX3_N: J1.4
B230_TX3_P: J1.2
VREF_A_M2C: R160.2
NetJ1_108: J1.108 R160.1

Not connected (* = marked no-connect by the designer): J1 91* 121*

### Notes on the sheet
- B230_TX3_P
- B230_TX3_N
- GND
- B230_TX2_P
- B230_TX2_N
- B230_TX1_P
- B230_TX1_N
- B230_TX0_P
- B230_TX0_N
- B229_TX3_P
- B229_TX3_N
- B229_TX2_P
- B229_TX2_N
- B229_TX1_P
- B229_TX1_N
- B229_TX0_P
- B229_TX0_N
- B228_TX3_P
- B228_TX3_N
- B228_TX2_P
- B228_TX2_N
- B228_TX1_P
- B228_TX1_N
- B228_TX0_P
- B228_TX0_N
- B66_L9_P
- B66_L9_N
- B66_L24_N
- B66_L24_P
- B66_L13_P
- B66_L13_N
- VCCO_66
- B66_L11_N
- B66_L11_P
- (near R160) B66_L7_P
- (near R160) B66_L7_N
- (near R160) GND
- (near R160) B66_L21_N
- (near R160) B66_L21_P
- (near R160) VREF_66
- (near R160) B66_L23_N
- (near R160) B66_L23_P
- B66_L12_N
- B66_L12_P
- B66_L16_N
- B66_L16_P
- B66_L8_P
- B66_L8_N
- B66_L15_P
- B66_L15_N
- B66_L1_N
- B66_L1_P
- B66_L14_N
- B66_L14_P
- SFP1
- SFP2
- FMC1
- Out
- B230_RX3_P
- B230_RX3_N
- B230_RX2_P
- B230_RX2_N
- B230_RX1_P
- B230_RX1_N
- B230_RX0_P
- B230_RX0_N
- B229_RX3_P
- B229_RX3_N
- B229_RX2_P
- B229_RX2_N
- B229_RX1_P
- B229_RX1_N
- B229_RX0_P
- B229_RX0_N
- B228_RX3_P
- B228_RX3_N
- B228_RX2_P
- B228_RX2_N
- B228_RX1_P
- B228_RX1_N
- B228_RX0_P
- B228_RX0_N
- B66_L6_P
- B66_L6_N
- B66_L5_P
- B66_L5_N
- B66_L4_N
- B66_L4_P
- PL_1V8
- B66_L3_N
- B66_L3_P
- B66_L2_N
- B66_L2_P
- B66_L17_P
- B66_L17_N
- B66_L20_N
- B66_L20_P
- B66_L22_N
- B66_L22_P
- B66_L19_N
- B66_L19_P
- B66_L18_P
- B66_L18_N
- B66_L10_N
- B66_L10_P
- B66_T3
- B66_T2
- B66_T1
- B66_T0
- PL_DCIN
- Title:
- Number:
- Rev.
- Date:
- A4
- Copyright:
- Page
- of
- Filename:

### Library data of the parts
J1 = 27219: Samtec Ultra Fine Pitch Socket REF192552-01, 160 Pins; AN: 27219; Mixed: SMT; Preferred: Yes; HelpURL: B:\ad\adlib\datasheet\SS5-XX-X.XX-X-D-K-TR; H-ART: REF 192552-01
R160 = 22738: WID SMD 0R; AN: 22738; Mixed: SMT; Value: 0; Preferred: Yes; Case: 1005 (0402); Technology: TK100

## Sheet J2.schdoc: TEBF0808 - B2B-connector J2
size A4; DocumentNumber: TEBF0808; Revision: 04; SheetNumber: 4; SheetTotal: 36; Date: 2016-09-29; CompanyName: Trenz Electronic GmbH; Organization: Trenz Electronic GmbH
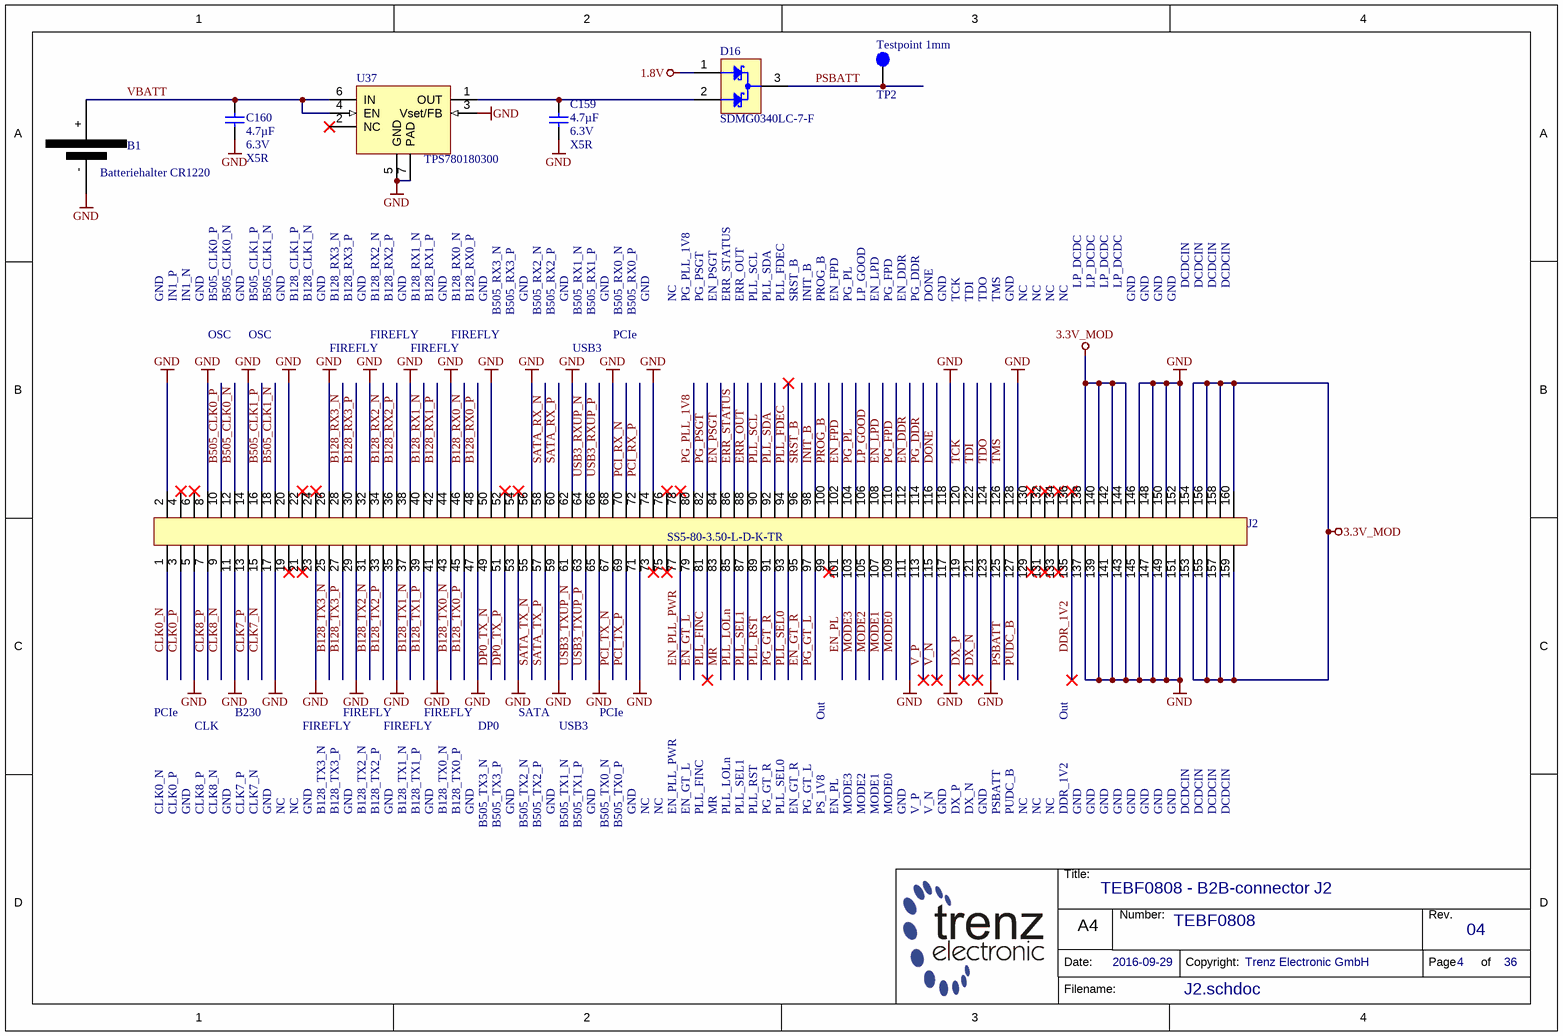
[diagram p17: J2.schdoc]

### Parts
B1  Batteriehalter CR1220  [CR1220]
C159  4.7µF  Voltage: 6.3V  Technology: X5R  [CAPC1005X60N]
C160  4.7µF  Voltage: 6.3V  Technology: X5R  [CAPC1005X60N]
D16  SDMG0340LC-7-F  [SOT65P210X110-3N]
J2  SS5-80-3.50-L-D-K-TR  [SS5-80-3.50-L-D-K-TR]
TP2  Testpoint 1mm  [TP_1mm]
U37  TPS780180300  [SON65P200X200X80-7N]

### Nets
1.8V: D16.1(A)
3.3V_MOD: J2.138 J2.140 J2.142 J2.144 J2.153 J2.154 J2.155 J2.156 J2.157 J2.158 J2.159 J2.160
GND: B1.- C159.2 C160.2 J2.2 J2.5 J2.8 J2.11 J2.14 J2.17 J2.20 J2.23 J2.26 J2.29 J2.32 J2.35 J2.38 J2.41 J2.44 J2.47 J2.50 J2.53 J2.56 J2.59 J2.62 J2.65 J2.68 J2.71 J2.74 J2.111 J2.117 J2.118 J2.123 J2.128 J2.137 J2.139 J2.141 J2.143 J2.145 J2.146 J2.147 J2.148 J2.149 J2.150 J2.151 J2.152 U37.3(Vset/FB) U37.5(GND) U37.7(PAD)
B128_RX0_N: J2.46
B128_RX0_P: J2.48
B128_RX1_N: J2.40
B128_RX1_P: J2.42
B128_RX2_N: J2.34
B128_RX2_P: J2.36
B128_RX3_N: J2.28
B128_RX3_P: J2.30
B128_TX0_N: J2.43
B128_TX0_P: J2.45
B128_TX1_N: J2.37
B128_TX1_P: J2.39
B128_TX2_N: J2.31
B128_TX2_P: J2.33
B128_TX3_N: J2.25
B128_TX3_P: J2.27
B505_CLK0_N: J2.12
B505_CLK0_P: J2.10
B505_CLK1_N: J2.18
B505_CLK1_P: J2.16
CLK0_N: J2.1
CLK0_P: J2.3
CLK7_N: J2.15
CLK7_P: J2.13
CLK8_N: J2.9
CLK8_P: J2.7
DDR_1V2: J2.135
DONE: J2.116
DP0_TX_N: J2.49
DP0_TX_P: J2.51
DX_N: J2.121
DX_P: J2.119
EN_DDR: J2.112
EN_FPD: J2.102
EN_GT_L: J2.79
EN_GT_R: J2.95
EN_LPD: J2.108
EN_PL: J2.101
EN_PLL_PWR: J2.77
EN_PSGT: J2.84
ERR_OUT: J2.88
ERR_STATUS: J2.86
INIT_B: J2.98
LP_GOOD: J2.106
MODE0: J2.109
MODE1: J2.107
MODE2: J2.105
MODE3: J2.103
MR: J2.83
PCI_RX_N: J2.70
PCI_RX_P: J2.72
PCI_TX_N: J2.67
PCI_TX_P: J2.69
PG_DDR: J2.114
PG_FPD: J2.110
PG_GT_L: J2.97
PG_GT_R: J2.91
PG_PL: J2.104
PG_PLL_1V8: J2.80
PG_PSGT: J2.82
PLL_FDEC: J2.94
PLL_FINC: J2.81
PLL_LOLn: J2.85
PLL_RST: J2.89
PLL_SCL: J2.90
PLL_SDA: J2.92
PLL_SEL0: J2.93
PLL_SEL1: J2.87
PROG_B: J2.100
PSBATT: D16.3(K) J2.125 TP2.1
PUDC_B: J2.127
SATA_RX_N: J2.58
SATA_RX_P: J2.60
SATA_TX_N: J2.55
SATA_TX_P: J2.57
SRST_B: J2.96
TCK: J2.120
TDI: J2.122
TDO: J2.124
TMS: J2.126
USB3_RXUP_N: J2.64
USB3_RXUP_P: J2.66
USB3_TXUP_N: J2.61
USB3_TXUP_P: J2.63
V_N: J2.115
V_P: J2.113
VBATT: B1.+ C160.1 U37.4(EN) U37.6(IN)
NetC159_1: C159.1 D16.2(A) U37.1(OUT)

Not connected (* = marked no-connect by the designer): J2 4* 6* 19* 21* 22* 24* 52* 54* 73* 75* 76* 78* 99* 129* 130* 131* 132* 133* 134* 136*; U37 2(NC)*

### Notes on the sheet
- GND
- IN1_P
- IN1_N
- B505_CLK0_P
- B505_CLK0_N
- B505_CLK1_P
- B505_CLK1_N
- B128_CLK1_P
- B128_CLK1_N
- B128_RX3_N
- B128_RX3_P
- B128_RX2_N
- B128_RX2_P
- B128_RX1_N
- B128_RX1_P
- B128_RX0_N
- B128_RX0_P
- B505_RX3_N
- B505_RX3_P
- B505_RX2_N
- B505_RX2_P
- B505_RX1_N
- B505_RX1_P
- B505_RX0_N
- B505_RX0_P
- NC
- PG_PLL_1V8
- PG_PSGT
- EN_PSGT
- ERR_STATUS
- ERR_OUT
- PLL_SCL
- PLL_SDA
- PLL_FDEC
- SRST_B
- INIT_B
- PROG_B
- EN_FPD
- PG_PL
- LP_GOOD
- EN_LPD
- PG_FPD
- EN_DDR
- PG_DDR
- DONE
- TCK
- TDI
- TDO
- TMS
- LP_DCDC
- DCDCIN
- OSC
- FIREFLY
- USB3
- PCIe
- B230
- SATA
- Out
- CLK
- DP0
- CLK0_N
- CLK0_P
- CLK8_P
- CLK8_N
- CLK7_P
- CLK7_N
- B128_TX3_N
- B128_TX3_P
- B128_TX2_N
- B128_TX2_P
- B128_TX1_N
- B128_TX1_P
- B128_TX0_N
- B128_TX0_P
- B505_TX3_N
- B505_TX3_P
- B505_TX2_N
- B505_TX2_P
- B505_TX1_N
- B505_TX1_P
- B505_TX0_N
- B505_TX0_P
- EN_PLL_PWR
- EN_GT_L
- PLL_FINC
- MR
- PLL_LOLn
- PLL_SEL1
- PLL_RST
- PG_GT_R
- PLL_SEL0
- EN_GT_R
- PG_GT_L
- PS_1V8
- EN_PL
- MODE3
- MODE2
- MODE1
- MODE0
- V_P
- V_N
- DX_P
- DX_N
- PSBATT
- PUDC_B
- DDR_1V2
- Title:
- Number:
- Rev.
- Date:
- A4
- Copyright:
- Page
- of
- Filename:

### Library data of the parts
B1 = 25140: AN: 25140; Mixed: SMT; Trenz-Stock: Yes; H-ART: BC501SM; Case: CD1220; HelpURL: B:\AD\adlib\datasheet\BC501SM
C159 C160 = 24719: KON 4.7µF 6.3V X5R SMD 20%; AN: 24719; Value: 4.7u; Mixed: SMT; Preferred: Yes; Case: 1005 (0402); Tolerance: 20%
D16 = 25051: AN: 25051; Mixed: SMT; Trenz-Stock: Yes; Case: SC70-3 / SOT323; HelpURL: B:\AD\adlib\datasheet\SDMG0340; H-ART: SDMG0340LC-7-F
J2 = 27219: as J1 on sheet J1; HelpURL: B:\ad\adlib\datasheet\SS5-XX-X.XX-X-D-K-TR; H-ART: REF 192552-01
TP2 = 25063: AN: 25063; Mixed: SMT
U37 = 25062: AN: 25062; Trenz-Stock: Yes; Mixed: SMT; Case: DRV; HelpURL: B:\AD\adlib\datasheet\TPS780; H-ART: TPS780180300

## Sheet J3.schdoc: TEBF0808 - B2B-connector J3
size A4; DocumentNumber: TEBF0808; Revision: 04; SheetNumber: 5; SheetTotal: 36; Date: 2016-09-29; CompanyName: Trenz Electronic GmbH; Organization: Trenz Electronic GmbH
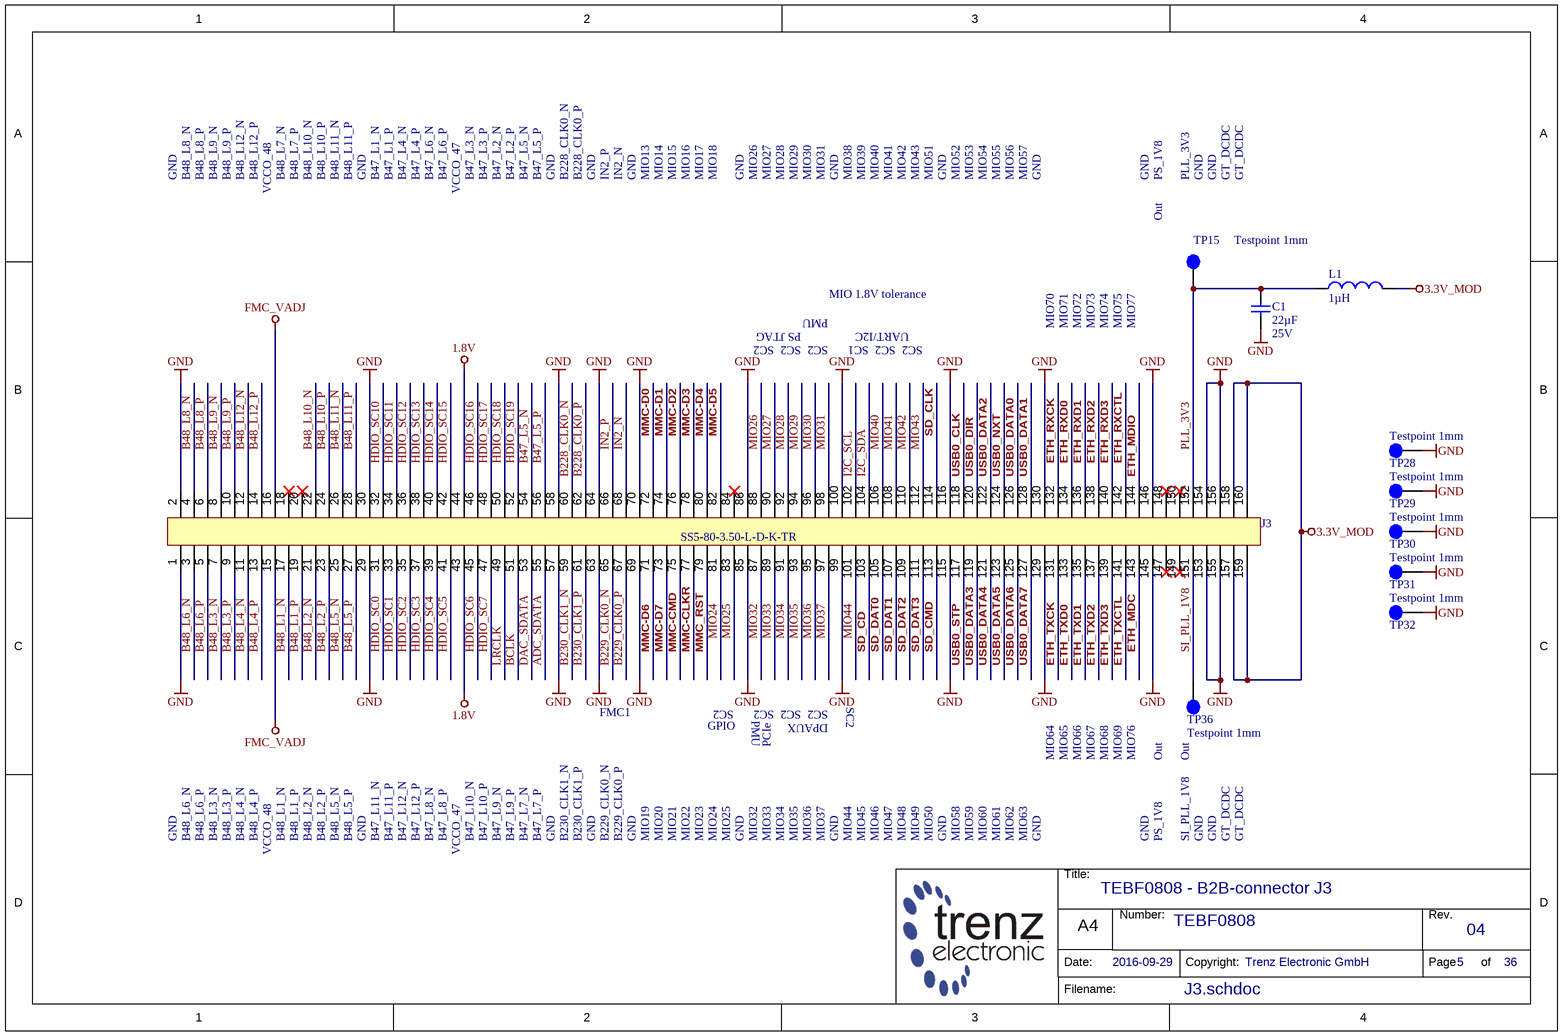
[diagram p18: J3.schdoc]

### Parts
C1  22µF  Voltage: 25V  [CAPC3216X180N]
J3  SS5-80-3.50-L-D-K-TR  [SS5-80-3.50-L-D-K-TR]
L1  1µH  [INDC2520X100N]
TP15  Testpoint 1mm  [TP_1mm]
TP28  Testpoint 1mm  [TP_1mm]
TP29  Testpoint 1mm  [TP_1mm]
TP30  Testpoint 1mm  [TP_1mm]
TP31  Testpoint 1mm  [TP_1mm]
TP32  Testpoint 1mm  [TP_1mm]
TP36  Testpoint 1mm  [TP_1mm]

### Nets
1.8V: J3.43 J3.44
3.3V_MOD: J3.157 J3.158 J3.159 J3.160 L1.2
FMC_VADJ: J3.15 J3.16
GND: C1.1 J3.1 J3.2 J3.29 J3.30 J3.57 J3.58 J3.63 J3.64 J3.69 J3.70 J3.85 J3.86 J3.99 J3.100 J3.115 J3.116 J3.129 J3.130 J3.145 J3.146 J3.153 J3.154 J3.155 J3.156 TP28.1 TP29.1 TP30.1 TP31.1 TP32.1
ADC_SDATA: J3.55
B47_L5_N: J3.54
B47_L5_P: J3.56
B48_L1_N: J3.17
B48_L1_P: J3.19
B48_L2_N: J3.21
B48_L2_P: J3.23
B48_L3_N: J3.7
B48_L3_P: J3.9
B48_L4_N: J3.11
B48_L4_P: J3.13
B48_L5_N: J3.25
B48_L5_P: J3.27
B48_L6_N: J3.3
B48_L6_P: J3.5
B48_L8_N: J3.4
B48_L8_P: J3.6
B48_L9_N: J3.8
B48_L9_P: J3.10
B48_L10_N: J3.22
B48_L10_P: J3.24
B48_L11_N: J3.26
B48_L11_P: J3.28
B48_L12_N: J3.12
B48_L12_P: J3.14
B228_CLK0_N: J3.60
B228_CLK0_P: J3.62
B229_CLK0_N: J3.65
B229_CLK0_P: J3.67
B230_CLK1_N: J3.59
B230_CLK1_P: J3.61
BCLK: J3.51
DAC_SDATA: J3.53
ETH_MDC: J3.143
ETH_MDIO: J3.144
ETH_RXCK: J3.132
ETH_RXCTL: J3.142
ETH_RXD0: J3.134
ETH_RXD1: J3.136
ETH_RXD2: J3.138
ETH_RXD3: J3.140
ETH_TXCK: J3.131
ETH_TXCTL: J3.141
ETH_TXD0: J3.133
ETH_TXD1: J3.135
ETH_TXD2: J3.137
ETH_TXD3: J3.139
HDIO_SC0: J3.31
HDIO_SC1: J3.33
HDIO_SC2: J3.35
HDIO_SC3: J3.37
HDIO_SC4: J3.39
HDIO_SC5: J3.41
HDIO_SC6: J3.45
HDIO_SC7: J3.47
HDIO_SC10: J3.32
HDIO_SC11: J3.34
HDIO_SC12: J3.36
HDIO_SC13: J3.38
HDIO_SC14: J3.40
HDIO_SC15: J3.42
HDIO_SC16: J3.46
HDIO_SC17: J3.48
HDIO_SC18: J3.50
HDIO_SC19: J3.52
I2C_SCL: J3.102
I2C_SDA: J3.104
IN2_N: J3.68
IN2_P: J3.66
LRCLK: J3.49
MIO24: J3.81
MIO25: J3.83
MIO26: J3.88
MIO27: J3.90
MIO28: J3.92
MIO29: J3.94
MIO30: J3.96
MIO31: J3.98
MIO32: J3.87
MIO33: J3.89
MIO34: J3.91
MIO35: J3.93
MIO36: J3.95
MIO37: J3.97
MIO40: J3.106
MIO41: J3.108
MIO42: J3.110
MIO43: J3.112
MIO44: J3.101
MMC-CLKR: J3.77
MMC-CMD: J3.75
MMC-D0: J3.72
MMC-D1: J3.74
MMC-D2: J3.76
MMC-D3: J3.78
MMC-D4: J3.80
MMC-D5: J3.82
MMC-D6: J3.71
MMC-D7: J3.73
MMC_RST: J3.79
PLL_3V3: C1.2 J3.152 L1.1 TP15.1
SD_CD: J3.103
SD_CLK: J3.114
SD_CMD: J3.113
SD_DAT0: J3.105
SD_DAT1: J3.107
SD_DAT2: J3.109
SD_DAT3: J3.111
SI_PLL_1V8: J3.151 TP36.1
USB0_CLK: J3.118
USB0_DATA0: J3.126
USB0_DATA1: J3.128
USB0_DATA2: J3.122
USB0_DATA3: J3.119
USB0_DATA4: J3.121
USB0_DATA5: J3.123
USB0_DATA6: J3.125
USB0_DATA7: J3.127
USB0_DIR: J3.120
USB0_NXT: J3.124
USB0_STP: J3.117

Not connected (* = marked no-connect by the designer): J3 18* 20* 84* 147* 148* 149* 150*

### Notes on the sheet
- GND
- B48_L8_N
- B48_L8_P
- B48_L9_N
- B48_L9_P
- B48_L12_N
- B48_L12_P
- B48_L7_N
- B48_L7_P
- B48_L10_N
- B48_L10_P
- B48_L11_N
- B48_L11_P
- B47_L1_N
- B47_L1_P
- B47_L4_N
- B47_L4_P
- B47_L6_N
- B47_L6_P
- B47_L3_N
- B47_L3_P
- B47_L2_N
- B47_L2_P
- B47_L5_N
- B47_L5_P
- B228_CLK0_N
- B228_CLK0_P
- IN2_P
- IN2_N
- MIO13
- MIO14
- MIO15
- MIO16
- MIO17
- MIO18
- MIO26
- MIO27
- MIO28
- MIO29
- MIO30
- MIO31
- MIO38
- MIO39
- MIO40
- MIO41
- MIO42
- MIO43
- MIO51
- MIO52
- MIO53
- MIO54
- MIO55
- MIO56
- MIO57
- PS_1V8
- PLL_3V3
- GT_DCDC
- VCCO_48
- VCCO_47
- (near TP15) Out
- MIO 1.8V tolerance
- PMU
- SC2
- PS JTAG
- SC1
- UART/I2C
- MIO70
- MIO71
- MIO72
- MIO73
- MIO74
- MIO75
- MIO77
- FMC1
- DPAUX
- GPIO
- PCIe
- MIO64
- MIO65
- MIO66
- MIO67
- MIO68
- MIO69
- MIO76
- (near TP36) Out
- B48_L6_N
- B48_L6_P
- B48_L3_N
- B48_L3_P
- B48_L4_N
- B48_L4_P
- B48_L1_N
- B48_L1_P
- B48_L2_N
- B48_L2_P
- B48_L5_N
- B48_L5_P
- B47_L11_N
- B47_L11_P
- B47_L12_N
- B47_L12_P
- B47_L8_N
- B47_L8_P
- B47_L10_N
- B47_L10_P
- B47_L9_N
- B47_L9_P
- B47_L7_N
- B47_L7_P
- B230_CLK1_N
- B230_CLK1_P
- B229_CLK0_N
- B229_CLK0_P
- MIO19
- MIO20
- MIO21
- MIO22
- MIO23
- MIO24
- MIO25
- MIO32
- MIO33
- MIO34
- MIO35
- MIO36
- MIO37
- MIO44
- MIO45
- MIO46
- MIO47
- MIO48
- MIO49
- MIO50
- MIO58
- MIO59
- MIO60
- MIO61
- MIO62
- MIO63
- SI_PLL_1V8
- Title:
- Number:
- Rev.
- Date:
- A4
- Copyright:
- Page
- of
- Filename:

### Library data of the parts
C1 = 24886: as C125 on sheet Power_1; Case: 3216 (1206); Tolerance: 10%
J3 = 27219: as J1 on sheet J1; HelpURL: B:\ad\adlib\datasheet\SS5-XX-X.XX-X-D-K-TR; H-ART: REF 192552-01
L1 = 25265: IND SMD 1µH +-20% 0.055Ohm; AN: 25265; Value: 1u; Trenz-Stock: Yes; Voltage: 1.7A; Mixed: SMT; H-ART: 74479787210a; Case: WE-PMI 2520(1008); HelpURL: B:\AD\adlib\datasheet\74479787210a; Technology: 0.055Ohm
TP15 TP28-TP32 TP36 = 25063: AN: 25063; Mixed: SMT

## Sheet J4.schdoc: TEBF0808 - B2B-connector J3
size A4; DocumentNumber: TEBF0808; Revision: 04; SheetNumber: 6; SheetTotal: 36; Date: 2016-09-29; CompanyName: Trenz Electronic GmbH; Organization: Trenz Electronic GmbH
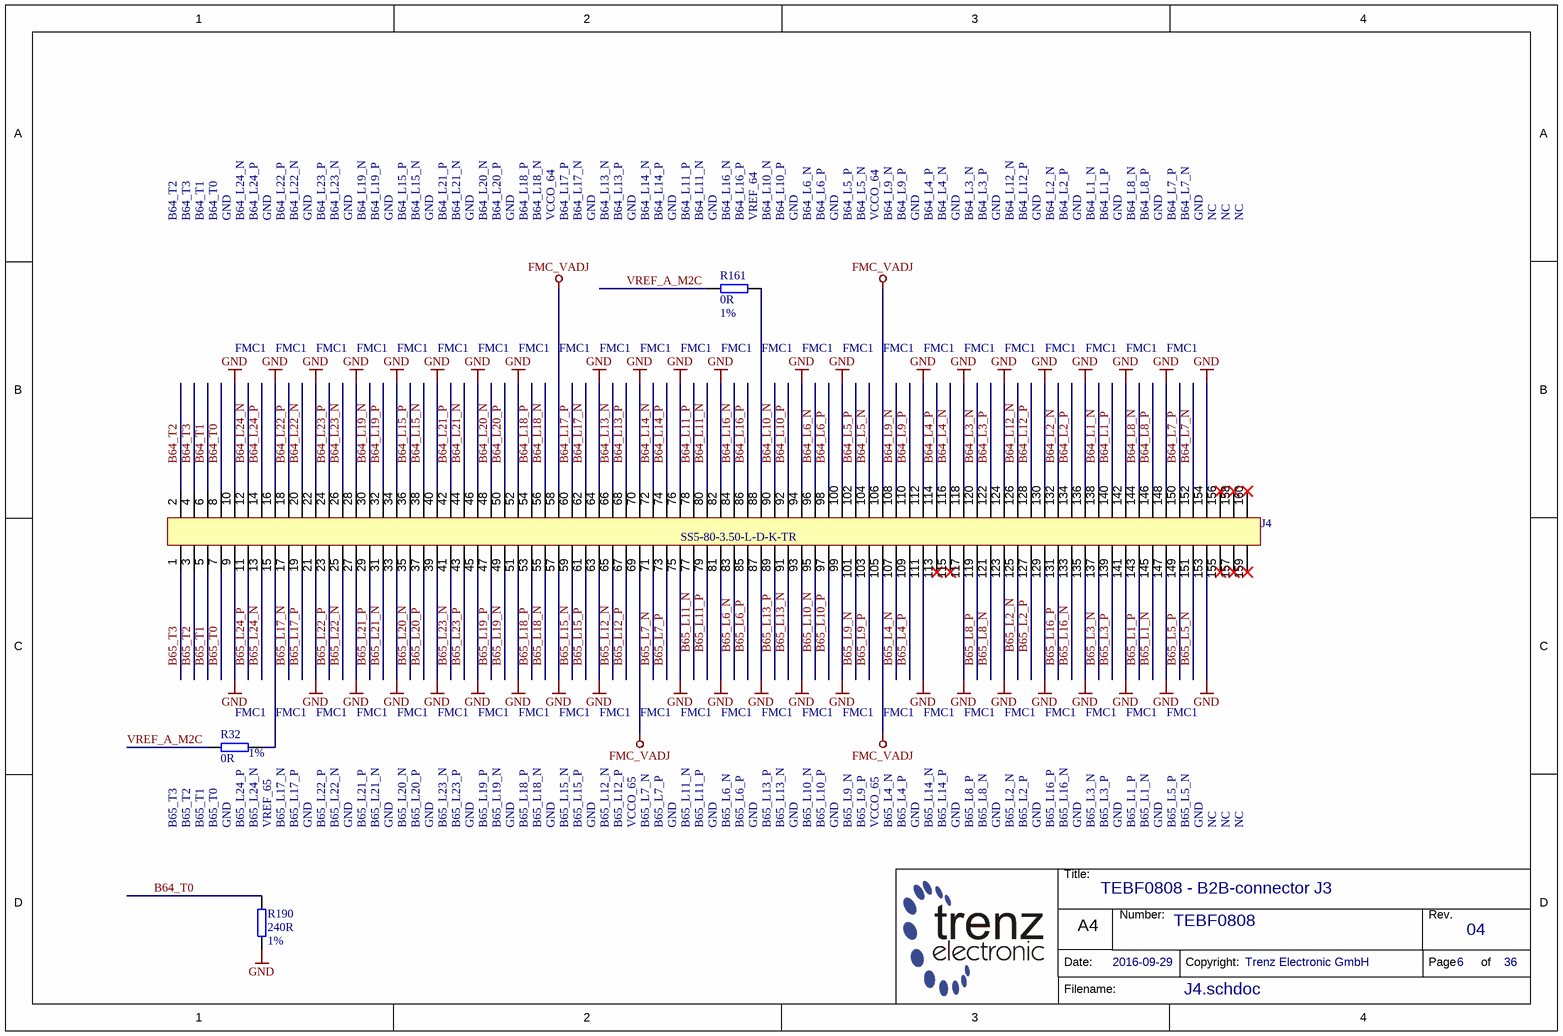
[diagram p19: J4.schdoc]

### Parts
J4  SS5-80-3.50-L-D-K-TR  [SS5-80-3.50-L-D-K-TR]
R32  0R  Tolerance: 1%  [RESC1005X40N]
R161  0R  Tolerance: 1%  [RESC1005X40N]
R190  240R  Tolerance: 1%  [RESC1005X40N]

### Nets
FMC_VADJ: J4.58 J4.69 J4.105 J4.106
GND: J4.9 J4.10 J4.16 J4.21 J4.22 J4.27 J4.28 J4.33 J4.34 J4.39 J4.40 J4.45 J4.46 J4.51 J4.52 J4.57 J4.63 J4.64 J4.70 J4.75 J4.76 J4.81 J4.82 J4.87 J4.93 J4.94 J4.99 J4.100 J4.111 J4.112 J4.117 J4.118 J4.123 J4.124 J4.129 J4.130 J4.135 J4.136 J4.141 J4.142 J4.147 J4.148 J4.153 J4.154 R190.2
B64_L1_N: J4.138
B64_L1_P: J4.140
B64_L2_N: J4.132
B64_L2_P: J4.134
B64_L3_N: J4.120
B64_L3_P: J4.122
B64_L4_N: J4.116
B64_L4_P: J4.114
B64_L5_N: J4.104
B64_L5_P: J4.102
B64_L6_N: J4.96
B64_L6_P: J4.98
B64_L7_N: J4.152
B64_L7_P: J4.150
B64_L8_N: J4.144
B64_L8_P: J4.146
B64_L9_N: J4.108
B64_L9_P: J4.110
B64_L10_N: J4.90
B64_L10_P: J4.92
B64_L11_N: J4.80
B64_L11_P: J4.78
B64_L12_N: J4.126
B64_L12_P: J4.128
B64_L13_N: J4.66
B64_L13_P: J4.68
B64_L14_N: J4.72
B64_L14_P: J4.74
B64_L15_N: J4.38
B64_L15_P: J4.36
B64_L16_N: J4.84
B64_L16_P: J4.86
B64_L17_N: J4.62
B64_L17_P: J4.60
B64_L18_N: J4.56
B64_L18_P: J4.54
B64_L19_N: J4.30
B64_L19_P: J4.32
B64_L20_N: J4.48
B64_L20_P: J4.50
B64_L21_N: J4.44
B64_L21_P: J4.42
B64_L22_N: J4.20
B64_L22_P: J4.18
B64_L23_N: J4.26
B64_L23_P: J4.24
B64_L24_N: J4.12
B64_L24_P: J4.14
B64_T0: J4.8 R190.1
B64_T1: J4.6
B64_T2: J4.2
B64_T3: J4.4
B65_L1_N: J4.145
B65_L1_P: J4.143
B65_L2_N: J4.125
B65_L2_P: J4.127
B65_L3_N: J4.137
B65_L3_P: J4.139
B65_L4_N: J4.107
B65_L4_P: J4.109
B65_L5_N: J4.151
B65_L5_P: J4.149
B65_L6_N: J4.83
B65_L6_P: J4.85
B65_L7_N: J4.71
B65_L7_P: J4.73
B65_L8_N: J4.121
B65_L8_P: J4.119
B65_L9_N: J4.101
B65_L9_P: J4.103
B65_L10_N: J4.95
B65_L10_P: J4.97
B65_L11_N: J4.77
B65_L11_P: J4.79
B65_L12_N: J4.65
B65_L12_P: J4.67
B65_L13_N: J4.91
B65_L13_P: J4.89
B65_L15_N: J4.59
B65_L15_P: J4.61
B65_L16_N: J4.133
B65_L16_P: J4.131
B65_L17_N: J4.17
B65_L17_P: J4.19
B65_L18_N: J4.55
B65_L18_P: J4.53
B65_L19_N: J4.49
B65_L19_P: J4.47
B65_L20_N: J4.35
B65_L20_P: J4.37
B65_L21_N: J4.31
B65_L21_P: J4.29
B65_L22_N: J4.25
B65_L22_P: J4.23
B65_L23_N: J4.41
B65_L23_P: J4.43
B65_L24_N: J4.13
B65_L24_P: J4.11
B65_T0: J4.7
B65_T1: J4.5
B65_T2: J4.3
B65_T3: J4.1
VREF_A_M2C: R32.2 R161.1
NetJ4_15: J4.15 R32.1
NetJ4_88: J4.88 R161.2

Not connected (* = marked no-connect by the designer): J4 113* 115* 155* 156* 157* 158* 159* 160*

### Notes on the sheet
- B64_T2
- B64_T3
- B64_T1
- B64_T0
- GND
- B64_L24_N
- B64_L24_P
- B64_L22_P
- B64_L22_N
- B64_L23_P
- B64_L23_N
- B64_L19_N
- B64_L19_P
- B64_L15_P
- B64_L15_N
- B64_L21_P
- B64_L21_N
- B64_L20_N
- B64_L20_P
- B64_L18_P
- B64_L18_N
- VCCO_64
- B64_L17_P
- B64_L17_N
- B64_L13_N
- B64_L13_P
- B64_L14_N
- B64_L14_P
- B64_L11_P
- B64_L11_N
- B64_L16_N
- B64_L16_P
- VREF_64
- B64_L10_N
- B64_L10_P
- B64_L6_N
- B64_L6_P
- B64_L5_P
- B64_L5_N
- B64_L9_N
- B64_L9_P
- B64_L4_P
- B64_L4_N
- B64_L3_N
- B64_L3_P
- B64_L12_N
- B64_L12_P
- B64_L2_N
- B64_L2_P
- B64_L1_N
- B64_L1_P
- B64_L8_N
- B64_L8_P
- B64_L7_P
- B64_L7_N
- NC
- FMC1
- (near R32) FMC1
- B65_T3
- (near R32) B65_T2
- (near R32) B65_T1
- (near R32) B65_T0
- (near R32) B65_L24_P
- (near R32) B65_L24_N
- (near R32) VREF_65
- (near R32) B65_L17_N
- (near R32) B65_L17_P
- B65_L22_P
- B65_L22_N
- B65_L21_P
- B65_L21_N
- B65_L20_N
- B65_L20_P
- B65_L23_N
- B65_L23_P
- B65_L19_P
- B65_L19_N
- B65_L18_P
- B65_L18_N
- B65_L15_N
- B65_L15_P
- B65_L12_N
- B65_L12_P
- VCCO_65
- B65_L7_N
- B65_L7_P
- B65_L11_N
- B65_L11_P
- B65_L6_N
- B65_L6_P
- B65_L13_P
- B65_L13_N
- B65_L10_N
- B65_L10_P
- B65_L9_N
- B65_L9_P
- B65_L4_N
- B65_L4_P
- B65_L14_N
- B65_L14_P
- B65_L8_P
- B65_L8_N
- B65_L2_N
- B65_L2_P
- B65_L16_P
- B65_L16_N
- B65_L3_N
- B65_L3_P
- B65_L1_P
- B65_L1_N
- B65_L5_P
- B65_L5_N
- Title:
- Number:
- Rev.
- Date:
- A4
- Copyright:
- Page
- of
- Filename:

### Library data of the parts
J4 = 27219: as J1 on sheet J1; HelpURL: B:\ad\adlib\datasheet\SS5-XX-X.XX-X-D-K-TR; H-ART: REF 192552-01
R32 R161 = 22738: as R160 on sheet J1; Case: 1005 (0402); Technology: TK100
R190 = 23661: WID SMD 240R 1% 0,063W; AN: 23661; Mixed: SMT; Value: 240; Preferred: Yes; Case: 1005 (0402); Technology: TK100

## Sheet USB3-HUB.SchDoc: TEBF0808 - USB
size A4; Organization: Trenz Electronic GmbH; DocumentNumber: TEBF0808; Revision: 04; SheetNumber: 15; SheetTotal: 36; Date: 2016-09-29; CompanyName: Trenz Electronic GmbH
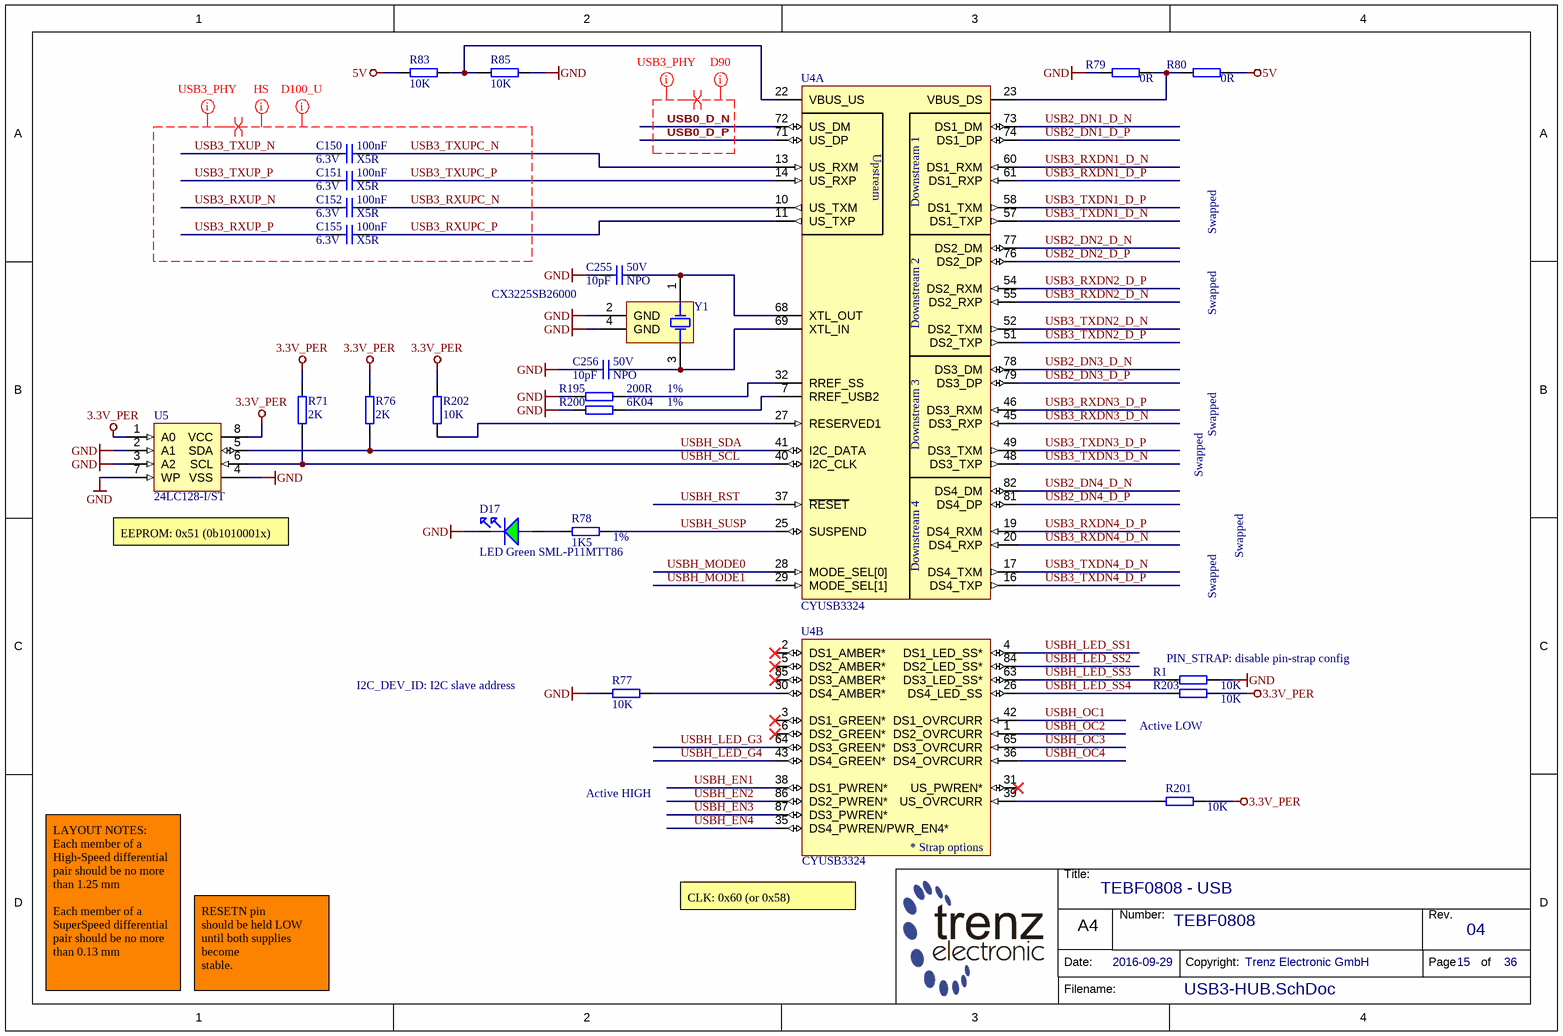
[diagram p20: USB3-HUB.SchDoc]

### Parts
C150  100nF  Voltage: 6.3V  Technology: X5R  [CAPC0603X33N]
C151  100nF  Voltage: 6.3V  Technology: X5R  [CAPC0603X33N]
C152  100nF  Voltage: 6.3V  Technology: X5R  [CAPC0603X33N]
C155  100nF  Voltage: 6.3V  Technology: X5R  [CAPC0603X33N]
C255  10pF  Voltage: 50V  Technology: NPO  [CAPC1005X55N]
C256  10pF  Voltage: 50V  Technology: NPO  [CAPC1005X55N]
D17  LED Green SML-P11MTT86  [LEDC1006X25N_GREEN]
R1  10K  [RESC1005X40N]
R71  2K  [RESC1005X40N]
R76  2K  [RESC1005X40N]
R77  10K  [RESC1005X40N]
R78  1K5  Tolerance: 1%  [RESC1005X40N]
R79  0R  [RESC1005X40N]
R80  0R  [RESC1005X40N]
R83  10K  [RESC1005X40N]
R85  10K  [RESC1005X40N]
R195  200R  Tolerance: 1%  [RESC1005X40N]
R200  6K04  Tolerance: 1%  [RESC1005X40N]
R201  10K  [RESC1005X40N]
R202  10K  [RESC1005X40N]
R203  10K  [RESC1005X40N]
U4  CYUSB3324  [QFN40P10X10X1-89T530]  (parts A,B of 3)
U5  24LC128-I/ST  [SOP65P640X120-8N-MC]
Y1  CX3225SB26000  [OSCCC320X250X60N]

### Nets
3.3V_PER: R71.2 R76.2 R201.1 R202.1 R203.1 U5.1(A0) U5.8(VCC)
5V: R80.1 R83.2
GND: C255.1 C256.1 D17.K R1.1 R77.1 R79.2 R85.1 R195.1 R200.1 U5.2(A1) U5.3(A2) U5.4(VSS) U5.7(WP) Y1.2(GND) Y1.4(GND)
USB0_D_N: U4.72(US_DM)
USB0_D_P: U4.71(US_DP)
USB2_DN1_D_N: U4.73(DS1_DM)
USB2_DN1_D_P: U4.74(DS1_DP)
USB2_DN2_D_N: U4.77(DS2_DM)
USB2_DN2_D_P: U4.76(DS2_DP)
USB2_DN3_D_N: U4.78(DS3_DM)
USB2_DN3_D_P: U4.79(DS3_DP)
USB2_DN4_D_N: U4.82(DS4_DM)
USB2_DN4_D_P: U4.81(DS4_DP)
USB3_RXDN1_D_N: U4.60(DS1_RXM)
USB3_RXDN1_D_P: U4.61(DS1_RXP)
USB3_RXDN2_D_N: U4.55(DS2_RXP)
USB3_RXDN2_D_P: U4.54(DS2_RXM)
USB3_RXDN3_D_N: U4.45(DS3_RXP)
USB3_RXDN3_D_P: U4.46(DS3_RXM)
USB3_RXDN4_D_N: U4.20(DS4_RXP)
USB3_RXDN4_D_P: U4.19(DS4_RXM)
USB3_RXUP_N: C152.1
USB3_RXUP_P: C155.1
USB3_RXUPC_N: C152.2 U4.10(US_TXM)
USB3_RXUPC_P: C155.2 U4.11(US_TXP)
USB3_TXDN1_D_N: U4.57(DS1_TXP)
USB3_TXDN1_D_P: U4.58(DS1_TXM)
USB3_TXDN2_D_N: U4.52(DS2_TXM)
USB3_TXDN2_D_P: U4.51(DS2_TXP)
USB3_TXDN3_D_N: U4.48(DS3_TXP)
USB3_TXDN3_D_P: U4.49(DS3_TXM)
USB3_TXDN4_D_N: U4.17(DS4_TXM)
USB3_TXDN4_D_P: U4.16(DS4_TXP)
USB3_TXUP_N: C150.1
USB3_TXUP_P: C151.1
USB3_TXUPC_N: C150.2 U4.13(US_RXM)
USB3_TXUPC_P: C151.2 U4.14(US_RXP)
USBH_EN1: U4.38(DS1_PWREN*)
USBH_EN2: U4.86(DS2_PWREN*)
USBH_EN3: U4.87(DS3_PWREN*)
USBH_EN4: U4.35(DS4_PWREN/PWR_EN4*)
USBH_LED_G3: U4.64(DS3_GREEN*)
USBH_LED_G4: U4.43(DS4_GREEN*)
USBH_LED_SS1: U4.4(DS1_LED_SS*)
USBH_LED_SS2: U4.84(DS2_LED_SS*)
USBH_LED_SS3: R1.2 U4.63(DS3_LED_SS*)
USBH_LED_SS4: R203.2 U4.26(DS4_LED_SS)
USBH_MODE0: U4.28(MODE_SEL[0])
USBH_MODE1: U4.29(MODE_SEL[1])
USBH_OC1: U4.42(DS1_OVRCURR)
USBH_OC2: U4.1(DS2_OVRCURR)
USBH_OC3: U4.65(DS3_OVRCURR)
USBH_OC4: U4.36(DS4_OVRCURR)
USBH_RST: U4.37(~{RESET})
USBH_SCL: R71.1 U4.40(I2C_CLK) U5.6(SCL)
USBH_SDA: R76.1 U4.41(I2C_DATA) U5.5(SDA)
USBH_SUSP: R78.1 U4.25(SUSPEND)
NetC255_2: C255.2 U4.68(XTL_OUT) Y1.1(OSC1)
NetC256_2: C256.2 U4.69(XTL_IN) Y1.3(OSC2)
NetD17_A: D17.A R78.2
NetR77_2: R77.2 U4.30(DS4_AMBER*)
NetR79_1: R79.1 R80.2 U4.23(VBUS_DS)
NetR83_1: R83.1 R85.2 U4.22(VBUS_US)
NetR195_2: R195.2 U4.32(RREF_SS)
NetR200_2: R200.2 U4.7(RREF_USB2)
NetR201_2: R201.2 U4.39(US_OVRCURR)
NetR202_2: R202.2 U4.27(RESERVED1)

Not connected (* = marked no-connect by the designer): U4 2(DS1_AMBER*)* 3(DS1_GREEN*)* 5(DS2_AMBER*)* 6(DS2_GREEN*)* 31(US_PWREN*)* 85(DS3_AMBER*)*

### Layout directives
net class USB3_PHY: USB0_D_N, USB0_D_P, USB3_RXUP_N, USB3_RXUP_P, USB3_RXUPC_N, USB3_RXUPC_P, USB3_TXUP_N, USB3_TXUP_P, USB3_TXUPC_N, USB3_TXUPC_P
differential pair: USB0_D_N, USB0_D_P, USB3_RXUP_N, USB3_RXUP_P, USB3_RXUPC_N, USB3_RXUPC_P, USB3_TXUP_N, USB3_TXUP_P, USB3_TXUPC_N, USB3_TXUPC_P
net class D90: USB0_D_N, USB0_D_P
net class HS: USB3_RXUP_N, USB3_RXUP_P, USB3_RXUPC_N, USB3_RXUPC_P, USB3_TXUP_N, USB3_TXUP_P, USB3_TXUPC_N, USB3_TXUPC_P
net class D100_U: USB3_RXUP_N, USB3_RXUP_P, USB3_RXUPC_N, USB3_RXUPC_P, USB3_TXUP_N, USB3_TXUP_P, USB3_TXUPC_N, USB3_TXUPC_P

### Notes on the sheet
- Swapped
- (near U5) EEPROM: 0x51 (0b1010001x)
- I2C_DEV_ID: I2C slave address
- (near R1) PIN_STRAP: disable pin-strap config
- Active LOW
- Active HIGH
- CLK: 0x60 (or 0x58)
- LAYOUT NOTES:
  Each member of a High-Speed differential pair should be no more than 1.25 mm
  Each member of a SuperSpeed differential pair should be no more than 0.13 mm
- RESETN pin
  should be held LOW until both supplies become
  stable.
- Title:
- Number:
- Rev.
- Date:
- A4
- Copyright:
- Page
- of
- Filename:
- (in symbol 27573, part A) Upstream; Downstream 1; Downstream 2; Downstream 3; Downstream 4
- (in symbol 27573, part B) * Strap options

### Library data of the parts
C150-C152 C155 = 24915: KON 100nF 6.3V X5R SMD 10%; AN: 24915; Mixed: SMT; Value: 100n; Preferred: Yes; Case: 0603 (0201); Tolerance: 10%
C255 C256 = 22597: KON 10pF NPO 50V SMD 5%; AN: 22597; Mixed: SMT; Value: 10p; Preferred: Yes; Case: 1005 (0402); Tolerance: 5%
D17 = 24211: LED Grün SML-P11MTT86 SMD; AN: 24211; Mixed: SMT; Preferred: Yes; Case: 1005 (0402); HelpURL: B:\AD\adlib\datasheet\SML-P1; H-ART: SML-P11MTT86
R1 R77 R83 R85 R201-R203 = 22750: as R153 on sheet Power_1; Tolerance: 1%; Case: 1005 (0402); Technology: TK100; Value: 10K
R71 R76 = 25073: WID SMD 2K 1% 0,063W; AN: 25073; Mixed: SMT; Tolerance: 1%; Case: 1005 (0402); Technology: TK100; Value: 2K
R78 = 22602: as R48 on sheet Power_1; Case: 1005 (0402); Technology: TK100
R79 R80 = 22738: as R154 on sheet Power_1; Case: 1005 (0402); Technology: TK100
R195 = 22758: WID SMD 200R 1% 0,063W; AN: 22758; Mixed: SMT; Value: 200; Preferred: Yes; Case: 1005 (0402); Technology: TK100
R200 = 24678: WID SMD 6K04 1% 0,063W; AN: 24678; Mixed: SMT; Value: 6.04K; Preferred: Yes; Case: 1005 (0402); Technology: TK100
U4 = 27573: CYUSB3324-88LTXC USB 3.0 Hub; AN: 27573; Mixed: SMT; Case: QFN88; HelpURL: b:\AD\adlib\datasheet\CYUSBx30x\; H-ART: CYUSB3324-88LTXC
U5 = 22933: AN: 22933; Mixed: SMT; Trenz-Stock: Yes; Case: TSSOP8; HelpURL: B:\AD\adlib\datasheet\24LC128; Preferred: Yes; H-ART: 24LC128-I/ST
Y1 = 27574: Quarz Crystal 26Mhz 10ppm 8pF -20C +70°C; AN: 27574; Mixed: SMT; Value: 26M; H-ART: CX3225SB26000D0FFFCC; HelpURL: b:\AD\adlib\datasheet\CX3225\

## Sheet Power_2.schdoc: TEBF0808 - Power
size A4; DocumentNumber: TEBF0808; Revision: 04; SheetNumber: 32; SheetTotal: 36; Date: 2016-09-29; CompanyName: Trenz Electronic GmbH; Organization: Trenz Electronic GmbH
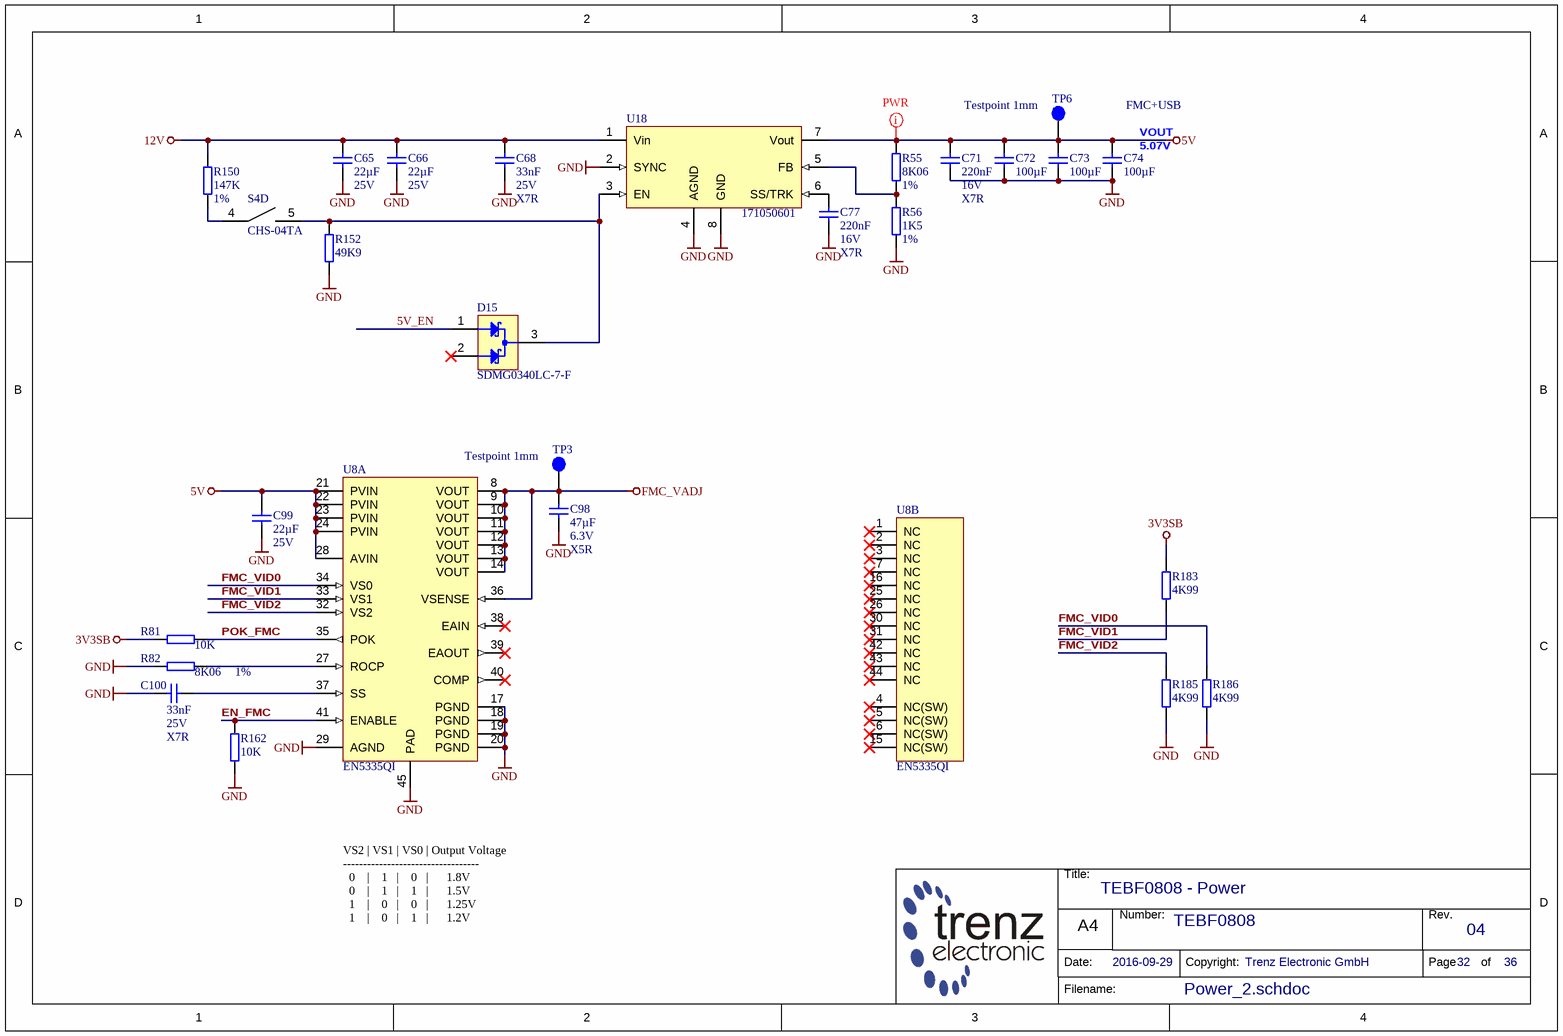
[diagram p21: Power_2.schdoc]

### Parts
C65  22µF  Voltage: 25V  [CAPC3216X180N]
C66  22µF  Voltage: 25V  [CAPC3216X180N]
C68  33nF  Voltage: 25V  Technology: X7R  [CAPC1005X55N]
C71  220nF  Voltage: 16V  Technology: X7R  [CAPC1005X55N]
C72  100µF  [CAPC3216X180N]
C73  100µF  [CAPC3216X180N]
C74  100µF  [CAPC3216X180N]
C77  220nF  Voltage: 16V  Technology: X7R  [CAPC1005X55N]
C98  47µF  Voltage: 6.3V  Technology: X5R  [CAPC3216X180N]
C99  22µF  Voltage: 25V  [CAPC3216X180N]
C100  33nF  Voltage: 25V  Technology: X7R  [CAPC1005X55N]
D15  SDMG0340LC-7-F  [SOT65P210X110-3N]
R55  8K06  Tolerance: 1%  [RESC1005X40N]
R56  1K5  Tolerance: 1%  [RESC1005X40N]
R81  10K  [RESC1005X40N]
R82  8K06  Tolerance: 1%  [RESC1005X40N]
R150  147K  Tolerance: 1%  [RESC1005X40N]
R152  49K9  [RESC1005X40N]
R162  10K  [RESC1005X40N]
R183  4K99  [RESC1005X40N]
R185  4K99  [RESC1005X40N]
R186  4K99  [RESC1005X40N]
S4  CHS-04TA  [CHS-04TA]  (part D of 4)
TP3  Testpoint 1mm  [TP_1mm]
TP6  Testpoint 1mm  [TP_1mm]
U8  EN5335QI  [EN5335QI]  (parts A,B of 2)
U18  171050601  [7TO-PMOD]

### Nets
3V3SB: R81.1 R183.1
5V: C71.1 C72.1 C73.1 C74.1 C99.2 R55.1 TP6.1 U8.21(PVIN) U8.22(PVIN) U8.23(PVIN) U8.24(PVIN) U8.28(AVIN) U18.7(Vout)
12V: C65.2 C66.2 C68.1 R150.2 U18.1(Vin)
FMC_VADJ: C98.1 TP3.1 U8.8(VOUT) U8.9(VOUT) U8.10(VOUT) U8.11(VOUT) U8.12(VOUT) U8.13(VOUT) U8.14(VOUT) U8.36(VSENSE)
GND: C65.1 C66.1 C68.2 C71.2 C72.2 C73.2 C74.2 C77.2 C98.2 C99.1 C100.1 R56.2 R82.1 R152.2 R162.1 R185.2 R186.2 U8.17(PGND) U8.18(PGND) U8.19(PGND) U8.20(PGND) U8.29(AGND) U8.45(PAD) U18.2(SYNC) U18.4(AGND) U18.8(GND)
5V_EN: D15.1(A)
EN_FMC: R162.2 U8.41(ENABLE)
FMC_VID0: R186.1 U8.34(VS0)
FMC_VID1: R183.2 U8.33(VS1)
FMC_VID2: R185.1 U8.32(VS2)
POK_FMC: R81.2 U8.35(POK)
NetC77_1: C77.1 U18.6(SS/TRK)
NetC100_2: C100.2 U8.37(SS)
NetD15_3: D15.3(K) R152.1 S4.5 U18.3(EN)
NetR55_2: R55.2 R56.1 U18.5(FB)
NetR82_2: R82.2 U8.27(ROCP)
NetR150_1: R150.1 S4.4

Not connected (* = marked no-connect by the designer): D15 2(A)*; U8 1(NC)* 2(NC)* 3(NC)* 4(NC(SW))* 5(NC(SW))* 6(NC(SW))* 7(NC)* 15(NC(SW))* 16(NC)* 25(NC)* 26(NC)* 30(NC)* 31(NC)* 38(EAIN)* 39(EAOUT)* 40(COMP)* 42(NC)* 43(NC)* 44(NC)*

### Layout directives
net class PWR: 5V

### Notes on the sheet
- FMC+USB
- (near C74) 5.07V
- (near C74) VOUT
- VS2 | VS1 | VS0 | Output Voltage
  ----------------------------------
  0    |    1   |    0   |      1.8V
  0    |    1   |    1   |      1.5V
  1    |    0   |    0   |      1.25V
  1    |    0   |    1   |      1.2V
- Title:
- Number:
- Rev.
- Date:
- A4
- Copyright:
- Page
- of
- Filename:

### Library data of the parts
C65 C66 C99 = 24886: as C125 on sheet Power_1; Case: 3216 (1206); Tolerance: 10%
C68 C100 = 23916: as C128 on sheet Power_1; Case: 1005 (0402)
C71 C77 = 22768: as C154 on sheet Power_1; Case: 1005 (0402)
C72-C74 = 23116: as C132 on sheet Power_1; Case: 3216 (1206); Tolerance: 20%; Technology: X5R
C98 = 24557: KON 47µF 6.3V  X5R SMD 20%; AN: 24557; Value: 47u; Mixed: SMT; Preferred: Yes; Case: 3216 (1206); Tolerance: 20%
D15 = 25051: AN: 25051; Mixed: SMT; Trenz-Stock: Yes; Case: SC70-3 / SOT323; HelpURL: B:\AD\adlib\datasheet\SDMG0340; H-ART: SDMG0340LC-7-F
R55 = 25052: WID SMD 8K06 1% 0,063W; AN: 25052; Mixed: SMT; Value: 8.06K; Preferred: Yes; Case: 1005 (0402); Technology: TK100
R56 = 22602: as R48 on sheet Power_1; Case: 1005 (0402); Technology: TK100
R81 R162 = 22750: as R153 on sheet Power_1; Case: 1005 (0402); Value: 10K; Tolerance: 1%; Technology: TK100
R82 = 25052: WID SMD 8K06 1% 0,063W; AN: 25052; Value: 8.06K; Mixed: SMT; Preferred: Yes; Case: 1005 (0402); Technology: TK100
R150 = 26470: WID SMD 147K 1% 0,063W; AN: 26470; Mixed: SMT; Preferred: Yes; Case: 1005 (0402); Technology: TK100; Value: 147K
R152 = 24677: WID SMD 49K9 1% 0,063W; AN: 24677; Mixed: SMT; Value: 49.9K; Preferred: Yes; Tolerance: 1%; Case: 1005 (0402); Technology: TK100
R183 R185 R186 = 22754: WID SMD 4K99 1% 0,063W; AN: 22754; Value: 4.99K; Mixed: SMT; Preferred: Yes; Case: 1005 (0402); Tolerance: 1%; Technology: TK100
S4 = 23417: as S4 on sheet SC2; HelpURL: B:\AD\adlib\datasheet\CHS; Preferred: Yes; H-ART: CHS-04TA
TP3 TP6 = 25063: AN: 25063; Mixed: SMT
U8 = 25127: AN: 25127; Trenz-Stock: Yes; Mixed: SMT; HelpURL: B:\AD\adlib\datasheet\EN5335QI; Preferred: Yes; H-ART: EN5335QI
U18 = 26051: AN: 26051; Mixed: SMT; Case: TO263-7EP; HelpURL: B:\AD\adlib\datasheet\171050601; H-ART: 171050601